# EasyEDA Pro project ProPrj_balance_vehicle_2024-12-26.epro, board balance_vehicle
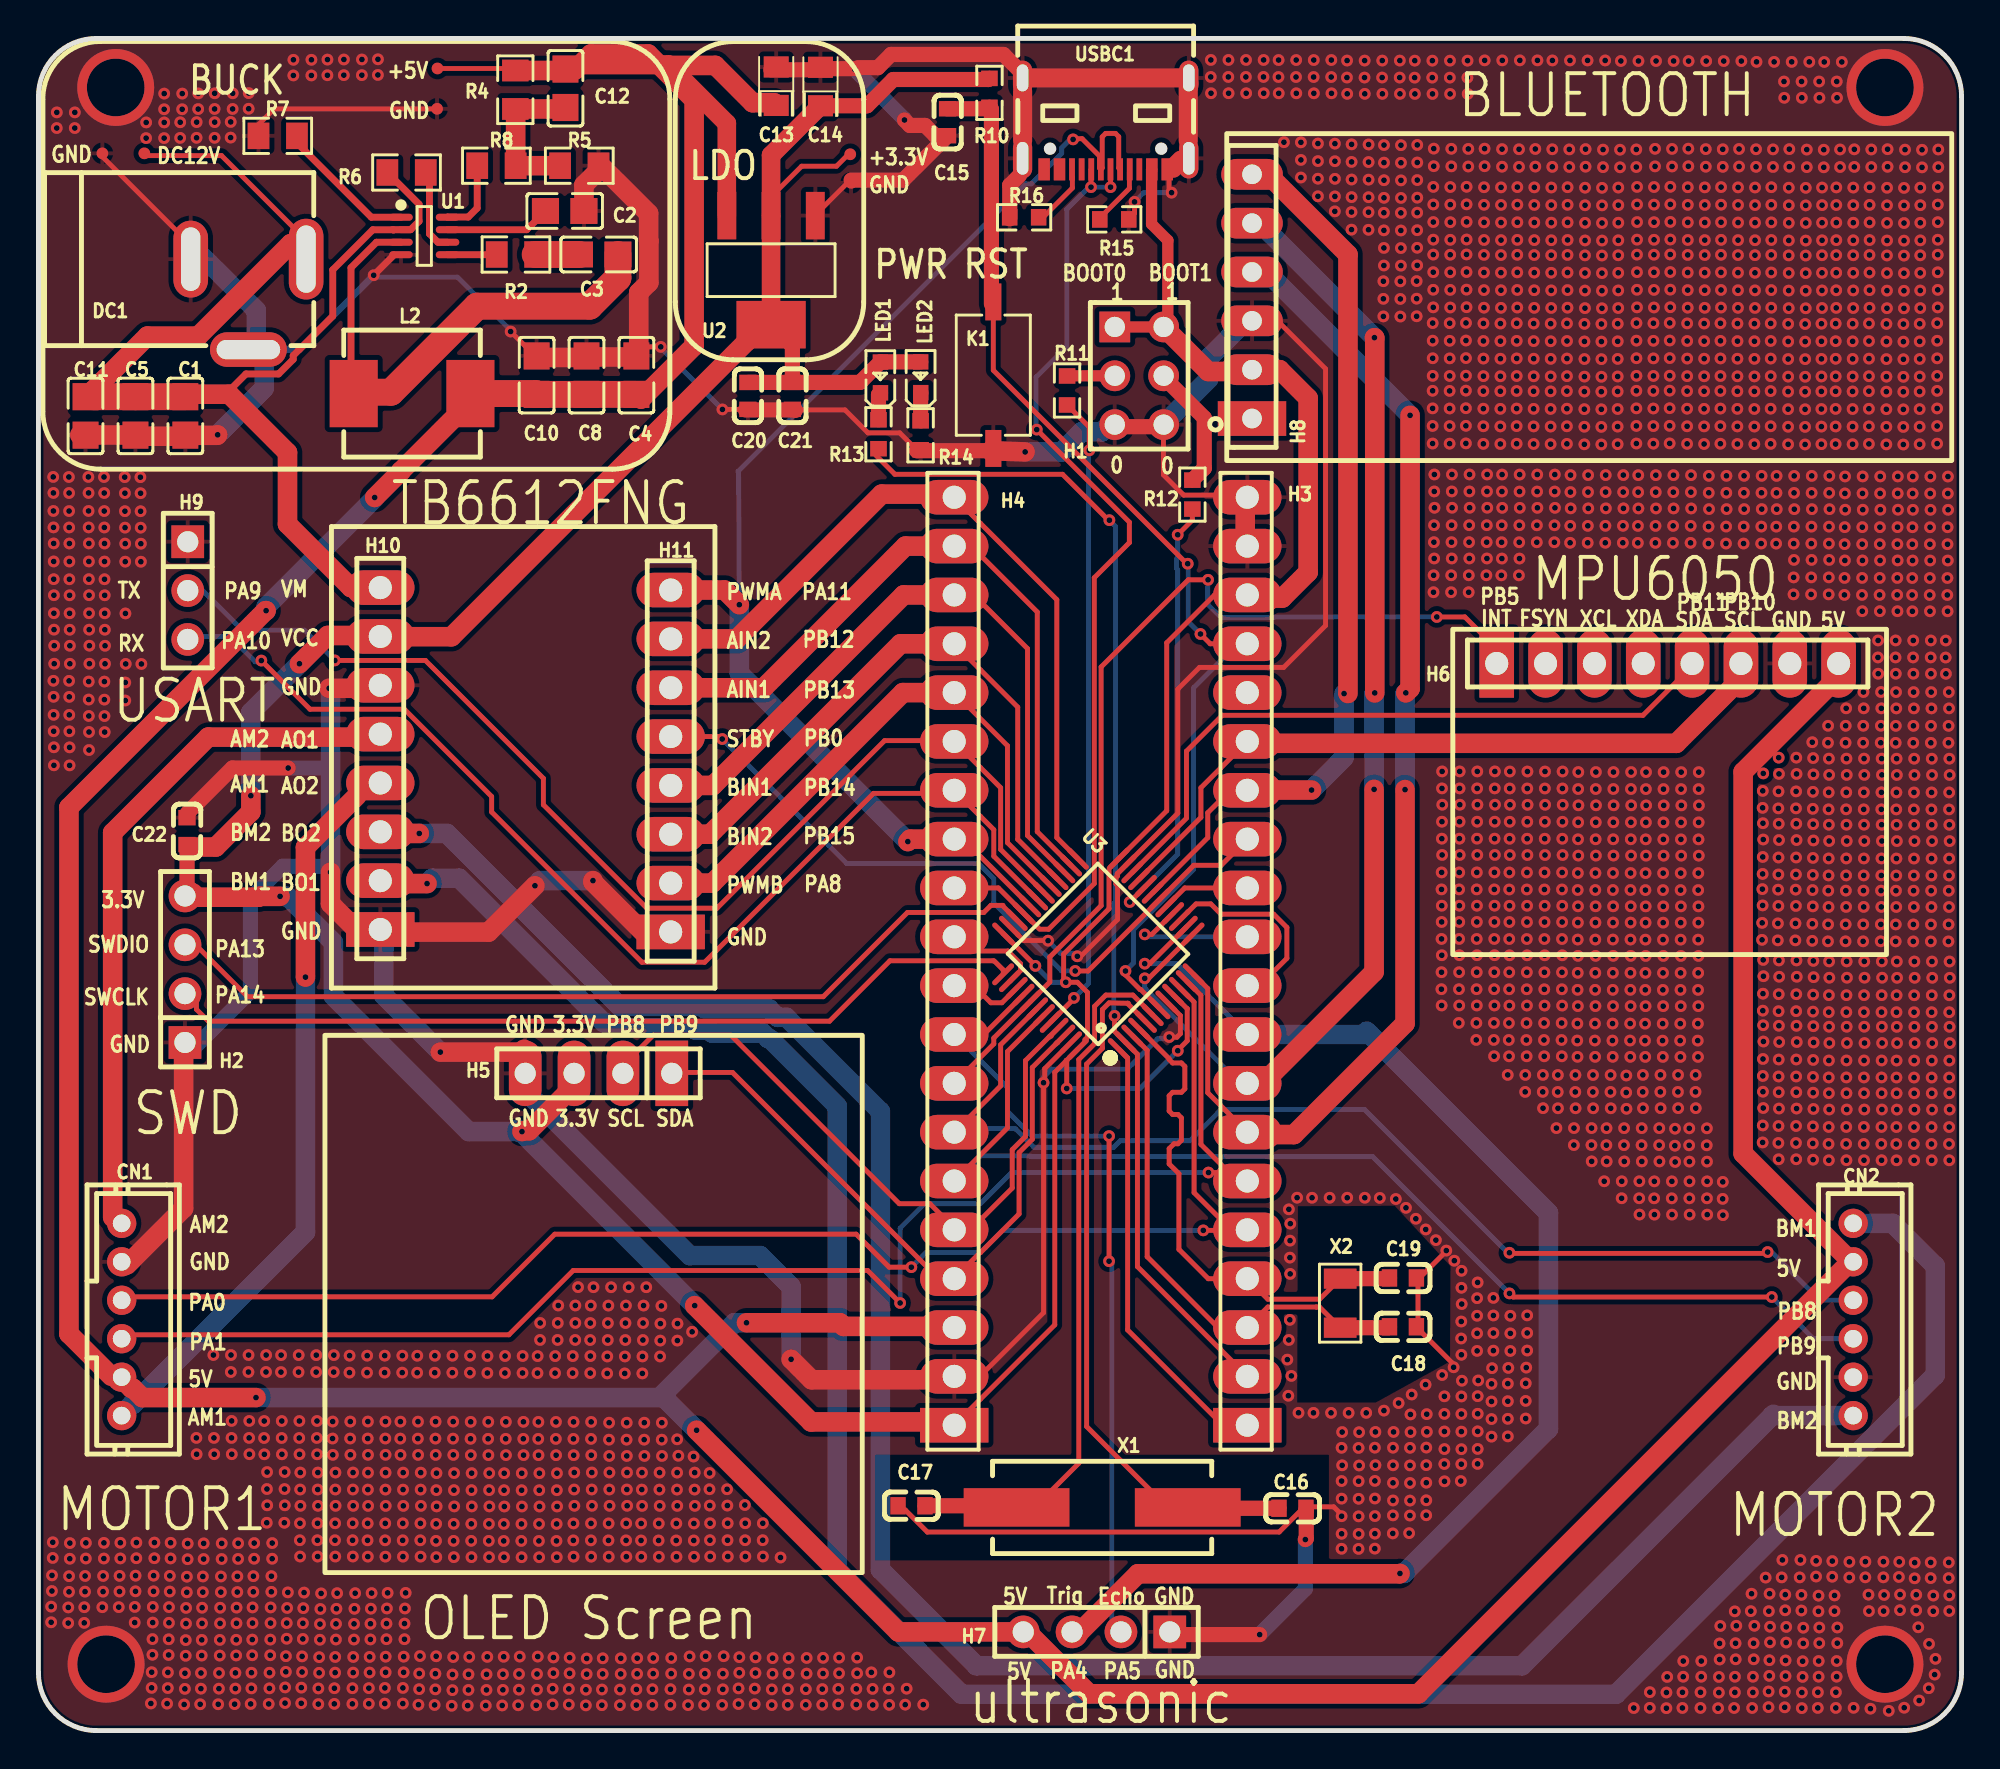
[diagram p2: board, top side]
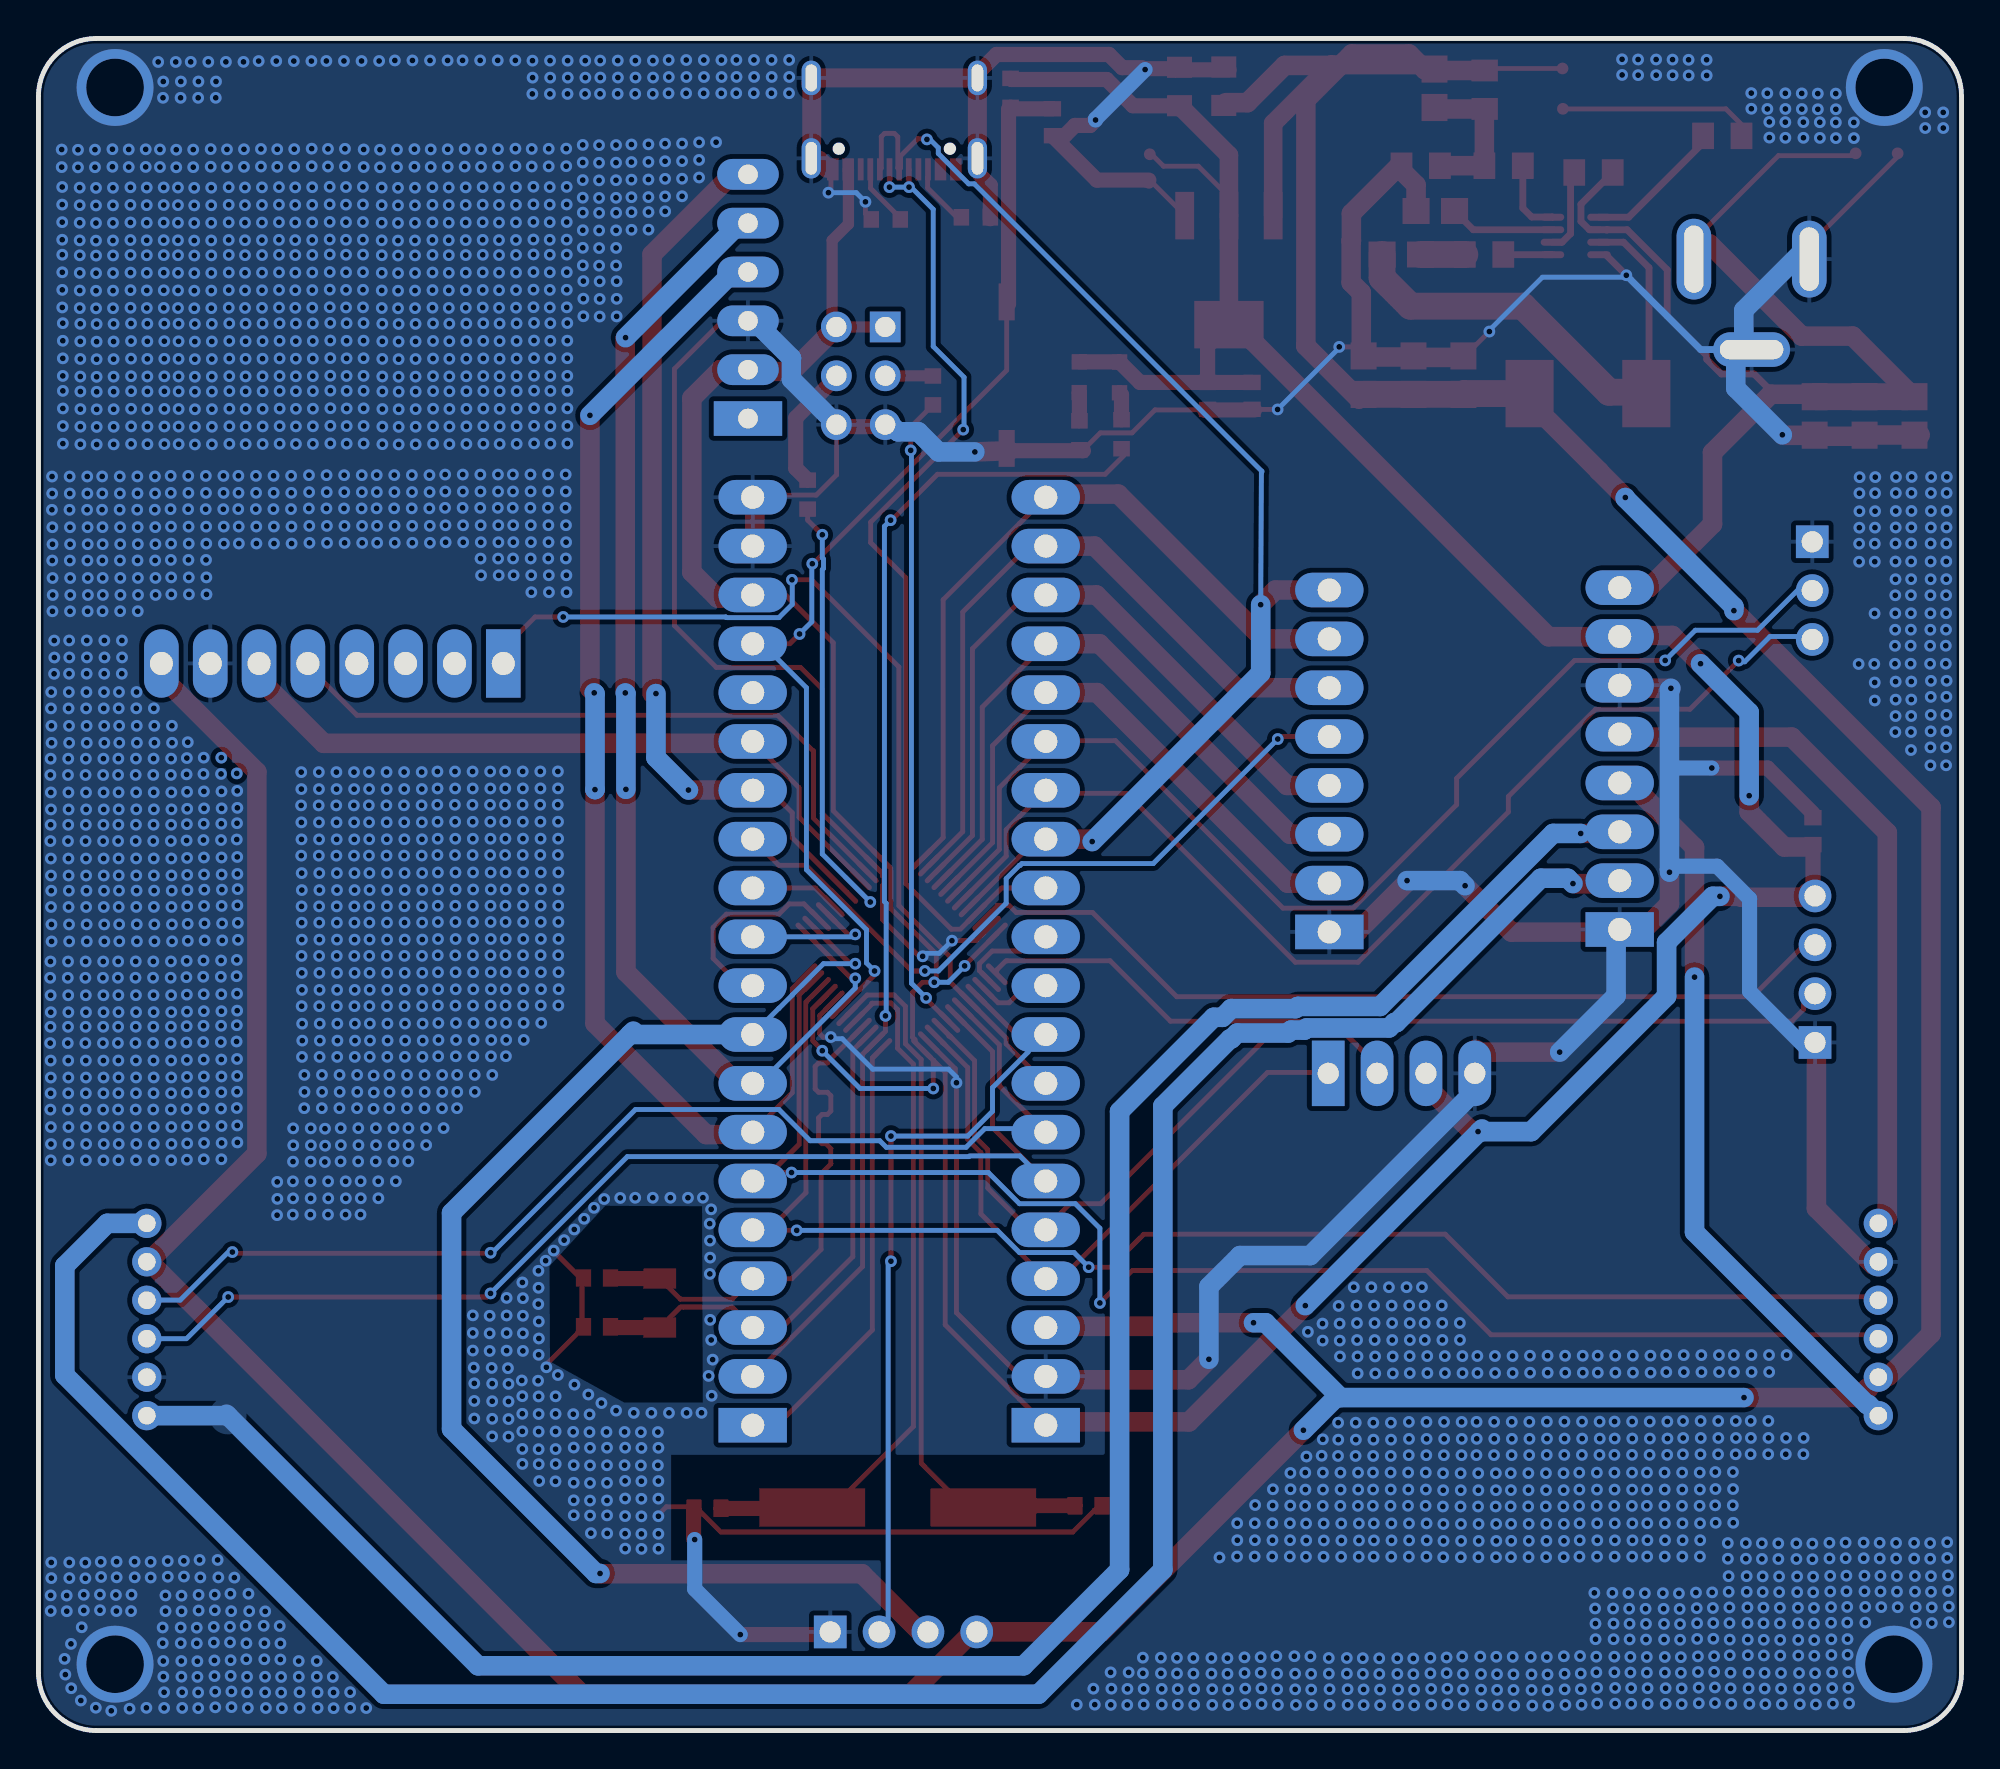
[diagram p3: board, bottom side, seen from below]

Outline 100 x 88 mm; copper layers: Top Layer, Bottom Layer. Coordinates in mm from the lower left corner of the outline.
Outline path: 0,85 0,3 arc(0.88,0.88) 3,0 97,0 arc(99.12,0.88) 100,3 100,85 arc(99.12,87.12) 97,88 3,88 arc(0.88,87.12) 0,85
Stack: Top Layer 0.035mm / Dielectric1 1.51mm FR4 er 4.5 / Bottom Layer 0.035mm

## Design rules (mm)
net PD0-OSC_IN: DP1
net PD1-OSC_OUT: DP1
net PC14: DP2
net PC15: DP2
template: JLCPCB Capability(Two Layers Board)
spacing copperThickness1oz (default): track to track 0.102, other pairs 0.152 to 0.3
spacing copperThickness2oz: track to track 0.203, other pairs 0.152 to 0.3
track width copperThickness1oz (default): min 0.127, default 0.254, max 2.54
track width copperThickness2oz: min 0.203, default 0.254, max 2.54
differential pair differentialPair (default): width min 0.127, default 0.254, max 2.54; gap min 0.152, default 0.152
via viaSize (default): diameter min 0.5, default 0.61, max 10; hole min 0.3, default 0.305, max 6.3

## Placement (name value [footprint] x y rotation side)
C1  100nF  [C0805]  7.64 68.37 90 top
C2  100nF  [C0805]  27.36 79.03 0 top
C3  100nF  [C0805]  29.13 76.76 0 top
C4  22uF  [C0805]  31.09 70.49 90 top
C5  22uF  [C0805]  5.04 68.37 90 top
C8  22uF  [C0805]  28.5 70.49 90 top
C10  22uF  [C0805]  25.9 70.49 90 top
C11  22uF  [C0805]  2.45 68.37 90 top
C12  220pF  [C0805]  27.41 85.41 90 top
C13  10uF  [CAP-SMD_L2.0-W1.3-FD]  38.36 85.52 90 top
C14  10uF  [CAP-SMD_L2.0-W1.3-FD]  40.66 85.5 90 top
C15  1uF  [C0603]  47.27 83.64 270 top
C16  20pF  [C0603]  65.21 11.56 180 top
C17  20pF  [C0603]  45.4 11.69 0 top
C18  10pF  [C0603]  70.95 21 180 top
C19  10pF  [C0603]  70.95 23.54 180 top
C20  100nF  [C0603]  36.89 69.41 270 top
C21  100nF  [C0603]  39.2 69.41 270 top
C22  100nF  [C0603]  7.72 46.78 270 top
CN1  PH2.0D-L-6P  [CONN-TH_6P_PH2.0D-L-6P]  4.33 21.38 270 top
CN2  PH2.0D-L-6P  [CONN-TH_6P_PH2.0D-L-6P]  94.37 21.38 270 top
DC1  DC-005-5A-2.0  [DC-IN-TH_DC-005-5A-2.0]  10.92 74.17 0 top
H1  -  [HDR-TH_6P-P2.54-V-R2-C3-S2.54_A2541WV-2X3P]  57.24 70.46 270 top
H2  -  [HDR-TH_4P-P2.54-V-M]  7.62 39.59 90 top
H3  -  [HDR-TH_20P-P2.54-V-M-1]  62.86 40.01 90 top
H4  -  [HDR-TH_20P-P2.54-V-M-1]  47.62 40.01 90 top
H5  -  [hdr-th_4p-p2.54-v-f]  29.12 34.18 180 top
H6  -  [HDR-TH_8P-P2.54-V-F-1]  84.72 55.49 0 top
H7  -  [hdr-th_4p-p2.54-v-f#2]  55.02 5.13 180 top
H8  -  [hdr-th_6p-p2.54-v-f]  63.1 74.58 90 top
H9  -  [HDR-TH_3P-P2.54-V-M]  7.76 59.29 270 top
H10  -  [HDR-TH_8P-P2.54-V-F-1]  17.78 50.55 90 top
H11  -  [HDR-TH_8P-P2.54-V-F-1]  32.88 50.42 90 top
K1  轻触按键 3x6x2.5mm  [SW-SMD_L6.1-W3.7-LS8.0]  49.65 70.49 270 top
L2  3.3uH  [IND-SMD_L7.1-W6.6_MJC-0603T]  19.43 69.53 180 top
LED1  -  [LED_0603]  43.78 70.42 90 top
LED2  -  [LED_0603]  45.87 70.43 90 top
NOREF  -  [Pad_e5843]  20.73 84.34 0 top
NOREF#2  -  [Pad_e5989]  42.26 80.49 0 top
NOREF#3  -  [Pad_e5856]  3.32 82.03 0 top
NOREF#4  -  [Pad_e5842]  20.75 86.44 0 top
NOREF#5  -  [Pad_e5857]  5.51 82.03 0 top
NOREF#6  -  [Pad_e5990]  42.21 81.98 0 top
R2  10R  [R0805]  24.83 76.76 0 top
R4  100K  [R0805]  24.8 85.33 90 top
R5  13.7K  [R0805]  28.12 81.38 0 top
R6  100K  [R0805]  19.14 81.03 0 top
R7  0R  [R0805]  12.44 82.94 0 top
R8  0R  [R0805]  23.81 81.38 0 top
R10  10K  [R0603]  49.45 85.17 270 top
R11  100K  [R0603]  53.49 69.69 90 top
R12  100K  [R0603]  60 64.28 270 top
R13  510R  [R0603]  43.68 67.42 270 top
R14  510R  [R0603]  45.87 67.36 270 top
R15  5.1K  [R0603]  55.94 78.59 0 top
R16  5.1K  [R0603]  51.26 78.7 180 top
U1  MP2236  [SOT-23-8_L3.0-W1.7-P0.65-LS2.8-BL]  20.06 77.73 270 top
U2  AMS1117-3.3  [SOT-223-4_L6.5-W3.5-P2.30-LS7.0-BR]  38.1 75.95 90 top
U3  STM32F103C8T6  [LQFP-48_L7.0-W7.0-P0.50-LS9.0-BL]  55.11 40.39 45 top
USBC1  MC-311D  [USB-C-SMD_MC-311D]  55.49 83.57 180 top
X1  8MHz  [CRYSTAL-SMD_L11.5-W4.8-LS12.7]  55.31 11.6 180 top
X2  32.768kHz  [OSC-SMD_L3.2-W1.5]  67.69 22.23 270 top

## Footprints (pads in the part's own frame, mm; a bottom-side part is the same pattern mirrored in y, then rotated)
C0603
  rect 0.8x0.9 smd: 1(-0.7,0) 2(0.7,0)
C0805
  rect 1.41x1.35 smd: 1(-1,0) 2(1,0)
CAP-SMD_L2.0-W1.3-FD
  rect 1.1x1.3 smd: 1(-1,0) 2(1,0)
CONN-TH_6P_PH2.0D-L-6P
  round 1.524 hole 0.914: 1(-5,0) 2(-3,0) 3(-1,0) 4(1,0) 5(3,0) 6(5,0)
CRYSTAL-SMD_L11.5-W4.8-LS12.7
  rect 5.5x2 smd: 1(-4.45,0) 2(4.45,0)
DC-IN-TH_DC-005-5A-2.0
  oval 1.8x4.2 hole 1x3.5: 1(3,2.352)
  oval 1.8x4 hole 1x3.3: 2(-3,2.352)
  oval 4x1.8 hole 3.3x1: 3(-0.001,-2.352)
HDR-TH_3P-P2.54-V-M
  rect 1.7x1.7 hole 1.1: 1(-2.54,0)
  round 1.7 hole 1.1: 2(0,0) 3(2.54,0)
hdr-th_4p-p2.54-v-f
  rect 1.7x3.404 hole 1.1x0.003: 1(-3.81,0)
  oval 1.7x3.404 hole 1.1x0.003: 2(-1.27,0) 3(1.27,0) 4(3.81,0)
hdr-th_4p-p2.54-v-f#2
  rect 1.7x1.7 hole 1.1: 1(-3.81,0)
  round 1.7 hole 1.1: 2(-1.27,0) 3(1.27,0) 4(3.81,0)
HDR-TH_4P-P2.54-V-M
  rect 1.7x1.7 hole 1.1: 1(-3.81,0)
  round 1.7 hole 1.1: 2(-1.27,0) 3(1.27,0) 4(3.81,0)
hdr-th_6p-p2.54-v-f
  rect 1.8x3.556 hole 1.02x0.003: 1(-6.35,0)
  oval 1.6x3.2 hole 1.02x0.003: 2(-3.81,0) 3(-1.27,0) 4(1.27,0) 5(3.81,0) 6(6.35,0)
HDR-TH_6P-P2.54-V-R2-C3-S2.54_A2541WV-2X3P
  rect 1.6x1.6 hole 1.05: 1(-2.54,-1.27)
  round 1.6 hole 1.05: 2(-2.54,1.27) 3(0,-1.27) 4(0,1.27) 5(2.54,-1.27) 6(2.54,1.27)
HDR-TH_8P-P2.54-V-F-1
  rect 1.8x3.556 hole 1.2x0.003: 1(-8.89,0)
  oval 1.8x3.556 hole 1.2x0.003: 2(-6.35,0) 3(-3.81,0) 4(-1.27,0) 5(1.27,0) 6(3.81,0) 7(6.35,0) 8(8.89,0)
HDR-TH_20P-P2.54-V-M-1
  rect 1.8x3.556 hole 1.2x0.003: 1(-24.13,0)
  oval 1.8x3.556 hole 1.2x0.003: 2(-21.59,0) 3(-19.05,0) 4(-16.51,0) 5(-13.97,0) 6(-11.43,0) 7(-8.89,0) 8(-6.35,0) 9(-3.81,0) 10(-1.27,0) 11(1.27,0) 12(3.81,0) 13(6.35,0) 14(8.89,0) 15(11.43,0) 16(13.97,0) 17(16.51,0) 18(19.05,0) 19(21.59,0) 20(24.13,0)
IND-SMD_L7.1-W6.6_MJC-0603T
  rect 2.5x3.5 smd: 1(-3.035,0) 2(3.035,0)
LED_0603
  rect 0.8x0.8 smd: 1(-0.851,-0.01) 2(0.75,-0.005)
LQFP-48_L7.0-W7.0-P0.50-LS9.0-BL
  oval 0.27x1.5 smd: 1(-2.75,-4.25) 2(-2.25,-4.25) 3(-1.75,-4.25) 4(-1.25,-4.25) 5(-0.75,-4.25) 6(-0.25,-4.25) 7(0.25,-4.25) 8(0.75,-4.25) 9(1.25,-4.25) 10(1.75,-4.25) 11(2.25,-4.25) 12(2.75,-4.25) 25(2.75,4.25) 26(2.25,4.25) 27(1.75,4.25) 28(1.25,4.25) 29(0.75,4.25) 30(0.25,4.25) 31(-0.25,4.25) 32(-0.75,4.25) 33(-1.25,4.25) 34(-1.75,4.25) 35(-2.25,4.25) 36(-2.75,4.25)
  oval 1.5x0.27 smd: 13(4.25,-2.75) 14(4.25,-2.25) 15(4.25,-1.75) 16(4.25,-1.25) 17(4.25,-0.75) 18(4.25,-0.25) 19(4.25,0.25) 20(4.25,0.75) 21(4.25,1.25) 22(4.25,1.75) 23(4.25,2.25) 24(4.25,2.75) 37(-4.25,2.75) 38(-4.25,2.25) 39(-4.25,1.75) 40(-4.25,1.25) 41(-4.25,0.75) 42(-4.25,0.25) 43(-4.25,-0.25) 44(-4.25,-0.75) 45(-4.25,-1.25) 46(-4.25,-1.75) 47(-4.25,-2.25) 48(-4.25,-2.75)
OSC-SMD_L3.2-W1.5
  rect 1.05x1.7 smd: 1(-1.275,0) 2(1.275,0)
Pad_e5842
  round 0.61 smd: TP1(0,0)
Pad_e5843
  round 0.61 smd: TP2(0,0)
Pad_e5856
  round 0.61 smd: TP3(0,0)
Pad_e5857
  round 0.61 smd: TP4(0,0)
Pad_e5989
  round 0.61 smd: TP5(0,0)
Pad_e5990
  round 0.61 smd: TP6(0,0)
R0603
  rect 0.806x0.864 smd: 1(-0.753,0) 2(0.753,0)
R0805
  rect 1.133x1.377 smd: 1(-1,0) 2(1,0)
SOT-23-8_L3.0-W1.7-P0.65-LS2.8-BL
  oval 0.364x1.222 smd: 1(-0.975,-1.211) 2(-0.325,-1.211) 3(0.325,-1.211) 4(0.975,-1.211) 5(0.975,1.211) 6(0.325,1.211) 7(-0.325,1.211) 8(-0.975,1.211)
SOT-223-4_L6.5-W3.5-P2.30-LS7.0-BR
  rect 2.47x0.98 smd: 1(2.835,-2.3) 2(2.835,0) 3(2.835,2.3)
  rect 2.47x3.6 smd: 4(-2.835,0)
SW-SMD_L6.1-W3.7-LS8.0
  rect 1.92x0.84 smd: 1(3.81,0) 2(-3.81,0)
USB-C-SMD_MC-311D
  oval 1x2.1 hole 0.6x1.7: 1(-4.32,1.802) 4(4.32,1.802)
  oval 1x1.8 hole 0.6x1.4: 2(-4.32,-2.377) 3(4.32,-2.377)
  rect 0.6x1.15 smd: A1-B12(-3.2,2.377) A4-B9(-2.4,2.377) B1-A12(3.2,2.377) B4-A9(2.4,2.377)
  rect 0.3x1.15 smd: A5(-1.25,2.377) A6(-0.25,2.377) A7(0.25,2.377) A8(1.25,2.377) B5(1.75,2.377) B6(0.75,2.377) B7(-0.75,2.377) B8(-1.75,2.377)

## Nets
As in the schematic, except:
12V_DC: C1.2 C5.2 C11.2 DC1.1 H10.8 NOREF#5.TP4 R6.1 U1.2
+5V: C4.1 C8.1 C10.1 C12.2 C13.1 CN1.5 CN2.2 H4.3 H6.8 H7.4 L2.1 NOREF#4.TP1 R4.2 U2.3
GND: C1.1 C2.2 C4.2 C5.1 C8.2 C10.2 C11.1 C13.2 C14.2 C15.2 C16.1 C17.1 C18.1 C19.1 C20.2 C21.2 C22.1 CN1.2 CN2.5 DC1.2 DC1.3 H1.5 H1.6 H2.1 H3.19 H3.20 H4.2 H5.4 H6.7 H7.1 H8.3 H9.1 H10.1 H10.6 H11.1 K1.1 NOREF.TP2 NOREF#2.TP5 NOREF#3.TP3 R5.2 R7.1 R14.2 R15.2 R16.2 U1.4 U2.1 U3.8 U3.23 U3.35 U3.47 USBC1.1 USBC1.2 USBC1.3 USBC1.4 USBC1.A1-B12
SWD_3.3V: C14.1 C20.1 C21.1 C22.2 H1.1 H1.2 H2.4 H3.18 H4.1 H5.3 H8.2 H10.7 LED1.2 LED2.2 NOREF#6.TP6 R10.1 U2.2 U2.4 U3.9 U3.24 U3.36 U3.48 USBC1.A4-B9

Pads without a net: H6 2 3 4; H8 1; USBC1 A8 B1-A12 B4-A9 B8

## Via types
v1: diameter 0.61, hole 0.305, Top Layer to Bottom Layer, 2711 vias
v2: diameter 4, hole 3, Top Layer to Bottom Layer, 4 vias

## Routing (per net, layer and track width the routed paths; a pad name or vN(x,y) marks a point on that pad's centre or on a via; arc(x,y) is an arc through that point)
12V_DC: length 63.6
  Top Layer w0.254: 5.64,81.91 9.52,81.91 13.39,78.03
  Top Layer w0.355: R6.1 19.79,79.38 19.79,78.49 19.35,78.05 U1.2 ; 9.96,69.53 9.96,69.72 10.79,70.55 12.49,70.55 13.25,71.31 13.25,71.51 15.3,73.56 15.3,75.97 17.38,78.05 18.44,78.05 18.46,78.03
  Top Layer w1.016: 13.92,76.52 13.12,77.33 8.31,72.52 5.66,72.52 2.83,69.69 2.83,69.37 ; H10.8 16.25,59.44 12.95,62.74 12.95,66.47 9.92,69.5 7.76,69.5 C1.2
  Top Layer w1.397: 2.83,69.37 C5.2 C1.2
+5V: length 276.6
  Top Layer w0.254: NOREF#4.TP1 24.85,86.44 24.88,86.4
  Top Layer w0.965: 32.76,86.62 35.8,83.58 U2.3 ; 28.15,86.62 32.54,86.62
  Top Layer w1.016: v1(34.22,15.62) 44.71,5.13 H7.4 51.42,5.13 54.64,1.91 71.75,1.91 94.25,24.41 88.64,30.01 88.64,49.86 93.85,55.06 ; 32.54,86.62 32.78,86.62 ; 32.78,86.6 35.2,86.6 37.13,84.66 38.26,84.66 ; v1(11.31,17.32) 5.4,17.32 4.92,17.8 4.83,17.8 4.42,18.21 ; 21.51,68.16 18.85,65.51 18.85,65.5 v1(17.48,64.13) ; C4.1 31.34,69.25 34.1,72.01 34.1,84.8 32.28,86.62 31.71,87.19 28.73,87.19 27.9,86.36 27.45,86.36 C12.2 27.33,86.33 R4.2 ; 41.86,21.02 41.67,21.21 v1(36.82,21.21) ; v1(11.84,58.24) 11.82,58.24 1.59,48.01 1.59,20.63 3.79,18.43 ; 41.87,21.02 46.99,21.02
  Top Layer w1.397: C4.1 C8.1 C10.1 25.86,69.53 L2.1
  Bottom Layer w1.016: v1(36.82,21.21) 36.19,21.21 32.3,17.32 v1(11.31,17.32) ; v1(34.22,15.62) 32.54,17.31 32.54,17.35 ; v1(11.84,58.24) 11.84,58.44 17.48,64.09 v1(17.48,64.13)
  vias: v1(89.69,49.78) v1(90.49,50.6)
AGND: length 7.4
  Top Layer w0.355: U1.1 17.31,78.7 13.44,82.57 R7.2
GND: length 386.4
  Top Layer w0.254: 67.86,11.13 67.35,11.64 65.93,11.64 ; 44.54,11.47 45.07,11.47 46.22,10.32 64.52,10.32 65.67,11.47 ; 53.28,35.37 52.32,34.42 52.32,33.87 52.31,33.86 ; 56.11,44.58 56.11,44.45 56.03,44.37 56.03,44.03 56.11,43.95 56.11,42.18 54.2,40.27 v1(54.02,40.27) ; v1(24.55,72.76) 25.47,71.84 ; v1(52.26,33.69) 52.26,21.73 48.84,18.31 ; 58.5,67.42 58.5,65.31 59.55,64.25 61.25,64.25 61.58,63.92 ; 20.6,84.34 12.26,84.34 11.26,83.34 ; 58.79,80.77 58.79,80.11 v1(58.92,79.98) ; 71.74,21.05 71.74,23.49 ; 7.37,77.91 7.27,77.91 3.33,81.84 ; 52.36,41.02 52.3,41.09 51.23,41.09 50.92,41.4 ; 71.64,21 73.51,19.12 73.51,18.97 ; 31.36,71.64 31.67,71.96 v1(32.36,71.96) ; 64.52,73.29 64.56,73.26 64.56,73.19 66.93,70.82 66.93,57.47 64.75,55.29 60.37,55.29 59.25,54.17 59.25,47.71 ; 56.7,78.61 57,78.9 v1(57,79.5) ; 36.72,68.71 v1(35.56,68.71) ; 45.72,66.55 45.71,66.56 44.78,67.49 43.13,67.49 41.94,68.68 39.33,68.68 ; 65.93,11.46 65.98,11.41 ; 71.77,23.49 73.19,24.91 73.24,24.91 ; v1(58.8,36.07) 58.8,36.06 59.2,36.06 59.38,36.24 59.38,37.18 59.08,37.48 ; U3.23 59.25,47.7 ; 71.74,23.62 71.61,23.75 ; 40.35,78.77 42.08,80.5
  Top Layer w0.355: 18.49,76.75 v1(17.43,75.69)
  Top Layer w0.787: 39.36,68.66 39.33,68.68 36.76,68.68 ; 56.52,67.81 57.98,67.81 ; 65.93,11.52 65.93,9.98 v1(65.88,9.93) ; 51.04,86.31 50.18,87.17 44.33,87.17 43.65,86.48 42.62,86.48 ; v1(12.99,50.06) 10.09,50.06 7.74,47.71 ; 49.51,66.56 45.66,66.56 ; v1(45.03,83.76) 45.31,83.48 46.1,83.48 46.64,82.94 C15.2 44.96,80.63 42.26,80.63 ; 41.02,86.52 40.88,86.37 38.09,86.37 ; 49.56,66.56 49.67,66.67 ; 58.98,5.21 59.2,4.99 v1(63.5,4.99) ; 50.51,78.63 50.51,80.37 51.01,80.88 ; 41.04,86.43 42.41,86.43
  Top Layer w0.991: 51.18,82.69 51.18,85.25 ; 59,81.25 59.42,81.67 ; 59.79,82.69 59.79,85.64 59.82,85.67 ; 51.63,85.95 59.46,85.95
  Top Layer w1.016: 18.89,41.56 18.92,41.52 23.4,41.52 v1(25.82,43.94) ; v1(15.11,54.2) 17.73,54.2 17.85,54.33 ; 28.82,71.41 28.84,71.44 ; 28.84,71.44 31.09,71.44 ; 28.84,71.44 28.87,71.46 ; 25.9,71.41 28.4,71.41 ; 2.15,67.38 5.15,67.38 5.2,67.43 ; 4.61,24.22 7.55,27.16 7.55,35.34 ; v1(9.32,67.39) 9.29,67.36 7.92,67.36 ; 29.1,81.11 28.36,80.38 C2.2 ; 25.25,35.43 25.1,35.28 v1(20.9,35.28) ; 31.21,71.56 31.21,74.78 31.74,75.31 31.74,77.47 31.73,77.48 31.73,78.9 29.26,81.37 ; 5.15,67.31 7.78,67.31 ; 49.51,66.56 v1(51.31,66.5) ; 47.32,18.24 40.2,18.24 v1(39.14,19.31) ; v1(28.83,44.2) 28.83,44.13 31.44,41.52 ; 62.75,61.52 62.75,63.76 62.42,64.09 ; v1(15.19,44.64) 15.19,43 16.68,41.51
  Bottom Layer w0.254: v1(32.36,71.96) 32.36,71.91 v1(35.56,68.71) ; v1(52.5,41.08) 53.16,40.42 53.92,40.42 ; 17.47,75.58 21.79,75.58 24.55,72.82 v1(24.55,72.76) ; 52.27,33.68 52.27,33.99 52.67,34.4 56.62,34.4 58.2,35.98 58.7,35.98 ; v1(58.92,79.98) 57.48,79.98 v1(57,79.5)
  Bottom Layer w0.355: v1(17.43,75.69) 13.57,71.82 12.67,71.82
  Bottom Layer w0.787: v1(63.5,4.99) 65.88,7.36 v1(65.88,9.93) ; 8,35.42 11.02,38.44 11.02,43.26 12.71,44.95 15.03,44.95 15.19,44.79 15.27,44.71 ; v1(12.99,50.06) 15.11,50.06 ; v1(45.03,83.76) 45.03,83.81 v1(42.45,86.38)
  Bottom Layer w1.016: 55.69,67.93 55.31,67.54 54.24,67.54 53.2,66.5 v1(51.31,66.5) ; 11.32,72.57 11.32,73.86 8.41,76.77 ; v1(15.11,54.2) 15.19,54.13 v1(15.19,44.64) ; v1(39.14,19.31) 39.14,23.09 37.52,24.7 33.86,24.7 25.52,33.05 ; 58.91,68.35 60.84,70.28 60.84,71.38 62.56,73.09 62.68,73.09 ; v1(20.9,35.28) 17.96,38.22 17.96,42 ; 11.74,71.4 11.74,69.81 v1(9.32,67.39) ; v1(28.83,44.2) 26.08,44.2 v1(25.82,43.94)
  vias: v1(0.66,6.44) v1(0.66,5.63) v1(0.77,65.2) v1(0.75,9.79) v1(0.74,8.98) v1(0.7,8.07) v1(0.7,7.26) v1(0.78,64.36) v1(0.78,63.43) v1(0.78,62.57) v1(0.79,61.74) v1(0.79,60.8) v1(0.79,59.88) v1(0.8,59.05) v1(0.8,58.11) v1(0.81,57.25) v1(0.82,56.42) v1(0.82,55.48) v1(0.78,54.59) v1(0.79,53.76) v1(0.79,52.82) v1(0.79,51.97) v1(0.8,51.14) v1(0.8,50.2) v1(0.95,84.16) v1(0.95,83.34) v1(1.55,6.4) v1(1.55,5.59) v1(1.58,65.19) v1(1.59,64.36) v1(1.59,63.42) v1(1.6,62.57) v1(1.61,61.73) v1(1.61,60.8) v1(1.61,59.88) v1(1.62,59.04) v1(1.62,58.1) v1(1.62,57.25) v1(1.63,56.42) v1(1.63,55.48) v1(1.59,54.59) v1(1.6,53.76) v1(1.6,52.82) v1(1.61,51.97) v1(1.62,51.13) v1(1.62,50.2) v1(1.63,9.75) v1(1.63,8.94) v1(1.59,8.03) v1(1.59,7.21) v1(1.89,84.16) v1(1.89,83.34) v1(2.47,9.76) v1(2.46,8.95) v1(2.42,8.04) v1(2.42,7.22) v1(2.38,6.41) v1(2.38,5.6) v1(2.59,65.2) v1(2.6,64.36) v1(2.6,63.43) v1(2.61,62.57) v1(2.62,61.74) v1(2.62,60.8) v1(2.62,59.88) v1(2.63,59.05) v1(2.63,58.11) v1(2.64,57.25) v1(2.65,56.42) v1(2.65,55.48) v1(2.61,54.56) v1(2.61,53.62) v1(2.62,52.76) v1(2.63,51.93) v1(2.63,50.99) v1(3.36,8.04) v1(3.36,7.22) v1(3.32,6.41) v1(3.41,65.19) v1(3.42,64.36) v1(3.42,63.42) v1(3.42,62.57) v1(3.44,61.73) v1(3.44,60.8) v1(3.44,59.88) v1(3.45,59.04) v1(3.45,58.1) v1(3.45,57.25) v1(3.46,56.42) v1(3.46,55.48) v1(3.43,54.55) v1(3.43,53.62) v1(3.43,52.76) v1(3.44,51.93) v1(3.4,9.76) v1(3.4,8.95) v1(4.26,9.77) v1(4.25,8.95) v1(4.22,8.04) v1(4.21,7.23) v1(4.17,6.42) v1(4.49,65.19) v1(4.5,64.35) v1(4.5,63.42) v1(4.5,62.56) v1(4.51,61.73) v1(4.51,60.79) v1(4.52,58.1) v1(4.54,55.47) v1(4.51,54.51) v1(4.51,53.57) v1(5.05,8.05) v1(5.05,7.24) v1(5.01,6.43) v1(5,5.62) v1(5.09,9.78) v1(5.09,8.96) v1(5.3,65.18) v1(5.31,64.35) v1(5.31,63.41) v1(5.32,62.56) v1(5.33,61.72) v1(5.33,60.79) v1(5.35,55.47) v1(5.6,83.63) v1(5.6,82.82) v1(5.85,1.41) v1(5.95,6.43) v1(5.94,5.62) v1(5.93,4.76) v1(5.93,3.94) v1(5.89,3.03) v1(5.88,2.22) v1(6.03,9.78) v1(6.03,8.96) v1(5.99,8.05) v1(5.98,7.24) v1(6.54,85.13) v1(6.53,84.32) v1(6.54,83.63) v1(6.53,82.82) v1(6.73,3.02) v1(6.73,2.21) v1(6.69,1.4) v1(6.83,8.04) v1(6.83,7.23) v1(6.79,6.42) v1(6.78,5.6) v1(6.77,4.75) v1(6.77,3.93) v1(6.87,9.77) v1(6.87,8.95) v1(7.37,83.64) v1(7.37,82.83) v1(7.48,85.13) v1(7.47,84.32) v1(7.66,4.7) v1(7.66,3.89) v1(7.62,2.98) v1(7.61,2.17) v1(7.58,1.36) v1(7.76,9.72) v1(7.76,8.91) v1(7.72,8) v1(7.71,7.19) v1(7.68,6.38) v1(7.67,5.56) v1(8.23,83.65) v1(8.22,82.83) v1(8.21,15.22) v1(8.22,14.37) v1(8.31,85.14) v1(8.31,84.33) v1(8.45,2.99) v1(8.45,2.18) v1(8.41,1.37) v1(8.55,8.01) v1(8.55,7.2) v1(8.51,6.39) v1(8.51,5.57) v1(8.49,4.71) v1(8.49,3.9) v1(8.59,9.73) v1(8.59,8.92) v1(9.16,85.15) v1(9.16,84.33) v1(9.16,83.65) v1(9.16,82.83) v1(9.1,19.53) v1(9.12,15.22) v1(9.14,14.37) v1(9.35,1.37) v1(9.45,6.39) v1(9.44,5.57) v1(9.43,4.71) v1(9.43,3.9) v1(9.39,2.99) v1(9.38,2.18) v1(9.53,9.73) v1(9.53,8.92) v1(9.49,8.01) v1(9.48,7.2) v1(10,83.66) v1(9.99,82.84) v1(10.01,19.53) v1(10,18.65) v1(10.05,16.1) v1(10.04,15.22) v1(10.05,14.37) v1(10.1,85.15) v1(10.1,84.33) v1(10.24,3) v1(10.24,2.18) v1(10.2,1.37) v1(10.34,8.02) v1(10.34,7.2) v1(10.3,6.39) v1(10.3,5.58) v1(10.28,4.72) v1(10.28,3.91) v1(10.38,9.74) v1(10.38,8.93) v1(10.93,85.16) v1(10.93,84.34) v1(10.92,19.53) v1(10.92,18.65) v1(10.96,16.1) v1(10.95,15.22) v1(10.97,14.37) v1(11.03,1.38) v1(11.13,6.4) v1(11.13,5.59) v1(11.12,4.73) v1(11.11,3.92) v1(11.08,3.01) v1(11.07,2.19) v1(11.22,9.75) v1(11.21,8.94) v1(11.18,8.03) v1(11.17,7.21) v1(11.74,16.1) v1(11.73,15.22) v1(11.75,14.37) v1(11.84,19.53) v1(11.83,18.65) v1(11.89,13.44) v1(11.88,12.56) v1(11.89,11.71) v1(11.87,10.81) v1(12.05,4.73) v1(12.05,3.92) v1(12.01,3.01) v1(12.01,2.19) v1(11.97,1.38) v1(12.16,9.75) v1(12.15,8.94) v1(12.11,8.03) v1(12.11,7.21) v1(12.07,6.4) v1(12.07,5.59) v1(12.62,19.53) v1(12.61,18.64) v1(12.65,16.1) v1(12.65,15.22) v1(12.66,14.37) v1(12.8,13.44) v1(12.8,12.56) v1(12.81,11.71) v1(12.79,10.81) v1(12.86,3.05) v1(12.83,2.24) v1(12.82,1.43) v1(12.93,6.37) v1(12.91,5.59) v1(12.91,4.78) v1(12.87,3.87) v1(12.97,7.19) v1(13.26,86.89) v1(13.25,86.08) v1(13.53,19.53) v1(13.52,18.64) v1(13.56,15.22) v1(13.57,16.1) v1(13.57,14.37) v1(13.61,13.42) v1(13.61,12.53) v1(13.62,11.69) v1(13.6,10.78) v1(13.59,9.9) v1(13.6,9.05) v1(13.66,1.42) v1(13.75,5.58) v1(13.75,4.76) v1(13.71,3.86) v1(13.71,3.04) v1(13.67,2.23) v1(13.81,7.18) v1(13.77,6.36) v1(14.19,86.89) v1(14.19,86.08) v1(14.45,19.53) v1(14.44,18.64) v1(14.48,16.1) v1(14.47,15.22) v1(14.49,14.37) v1(14.53,13.42) v1(14.52,12.53) v1(14.54,11.69) v1(14.51,10.78) v1(14.5,9.9) v1(14.52,9.05) v1(14.56,2.19) v1(14.55,1.38) v1(14.66,6.32) v1(14.64,5.54) v1(14.63,4.72) v1(14.6,3.82) v1(14.59,3) v1(14.7,7.13) v1(15.03,86.9) v1(15.02,86.09) v1(15.36,19.53) v1(15.35,18.64) v1(15.3,16.07) v1(15.29,15.19) v1(15.31,14.34) v1(15.44,13.42) v1(15.44,12.53) v1(15.45,11.69) v1(15.43,10.78) v1(15.42,9.9) v1(15.43,9.05) v1(15.43,3.83) v1(15.43,3.01) v1(15.39,2.2) v1(15.38,1.39) v1(15.53,7.14) v1(15.49,6.33) v1(15.47,5.55) v1(15.47,4.73) v1(15.88,86.91) v1(15.88,86.09) v1(16.18,19.5) v1(16.17,18.61) v1(16.21,16.07) v1(16.21,15.19) v1(16.22,14.34) v1(16.36,13.42) v1(16.35,12.53) v1(16.36,11.69) v1(16.34,10.78) v1(16.33,9.9) v1(16.35,9.05) v1(16.36,3.01) v1(16.33,2.2) v1(16.32,1.39) v1(16.43,6.33) v1(16.41,5.55) v1(16.41,4.73) v1(16.37,3.83) v1(16.47,7.14) v1(16.82,86.91) v1(16.82,86.09) v1(17.09,19.5) v1(17.09,18.61) v1(17.13,16.07) v1(17.12,15.19) v1(17.14,14.34) v1(17.14,13.41) v1(17.13,12.53) v1(17.14,11.68) v1(17.12,10.78) v1(17.11,9.89) v1(17.13,9.05) v1(17.26,5.55) v1(17.26,4.74) v1(17.22,3.83) v1(17.22,3.02) v1(17.18,2.21) v1(17.18,1.39) v1(17.32,7.15) v1(17.28,6.34) v1(17.65,86.92) v1(17.65,86.1) v1(18.01,19.5) v1(18,18.61) v1(18.04,16.07) v1(18.04,15.19) v1(18.05,14.34) v1(18.05,13.41) v1(18.04,12.53) v1(18.06,11.68) v1(18.03,10.78) v1(18.03,9.89) v1(18.04,9.05) v1(18.06,3.84) v1(18.05,3.03) v1(18.01,2.22) v1(18.01,1.4) v1(18.16,7.16) v1(18.12,6.35) v1(18.1,5.56) v1(18.09,4.75) v1(18.82,16.07) v1(18.81,15.18) v1(18.83,14.34) v1(18.92,19.5) v1(18.91,18.61) v1(18.96,13.41) v1(18.96,12.53) v1(18.95,10.78) v1(18.94,9.89) v1(18.95,9.05) v1(18.95,2.22) v1(18.95,1.4) v1(18.97,11.68) v1(19.06,6.35) v1(19.03,5.56) v1(19.03,4.75) v1(18.99,3.84) v1(18.99,3.03) v1(19.09,7.16) v1(19.7,19.49) v1(19.69,18.61) v1(19.74,16.07) v1(19.73,15.18) v1(19.74,14.34) v1(19.76,1.34) v1(19.86,10.78) v1(19.85,9.89) v1(19.84,3.87) v1(19.8,2.97) v1(19.8,2.15) v1(19.88,13.41) v1(19.87,12.53) v1(19.89,11.68) v1(19.87,9.05) v1(20.61,19.49) v1(20.61,18.61) v1(20.65,16.07) v1(20.64,15.18) v1(20.66,14.34) v1(20.64,2.96) v1(20.64,2.14) v1(20.6,1.33) v1(20.7,13.39) v1(20.69,12.5) v1(20.7,11.66) v1(20.68,10.75) v1(20.67,9.87) v1(20.69,9.02) v1(20.68,3.86) v1(21.53,19.49) v1(21.52,18.61) v1(21.56,16.07) v1(21.56,15.18) v1(21.53,2.91) v1(21.53,2.1) v1(21.49,1.29) v1(21.57,14.34) v1(21.61,13.39) v1(21.6,12.5) v1(21.62,11.66) v1(21.59,10.75) v1(21.59,9.87) v1(21.6,9.02) v1(21.57,3.82) v1(22.36,2.92) v1(22.36,2.11) v1(22.32,1.3) v1(22.44,19.49) v1(22.44,18.61) v1(22.4,3.83) v1(22.47,16.06) v1(22.47,15.17) v1(22.48,14.32) v1(22.53,13.39) v1(22.52,12.5) v1(22.53,11.66) v1(22.51,10.75) v1(22.5,9.87) v1(22.52,9.02) v1(23.26,1.3) v1(23.35,19.48) v1(23.34,18.59) v1(23.34,3.83) v1(23.3,2.92) v1(23.3,2.11) v1(23.39,16.06) v1(23.38,15.17) v1(23.4,14.32) v1(23.44,13.39) v1(23.43,12.5) v1(23.45,11.66) v1(23.42,10.75) v1(23.42,9.87) v1(23.43,9.02) v1(24.15,2.93) v1(24.15,2.12) v1(24.11,1.31) v1(24.26,19.48) v1(24.26,18.59) v1(24.22,13.38) v1(24.21,12.5) v1(24.22,11.65) v1(24.2,10.74) v1(24.19,9.86) v1(24.21,9.01) v1(24.19,3.84) v1(24.3,16.06) v1(24.3,15.17) v1(24.31,14.32) v1(24.95,1.31) v1(25.03,3.85) v1(24.99,2.94) v1(24.98,2.13) v1(25.13,13.38) v1(25.13,12.5) v1(25.14,11.65) v1(25.12,10.74) v1(25.11,9.86) v1(25.12,9.01) v1(25.18,19.48) v1(25.17,18.59) v1(25.22,16.06) v1(25.21,15.17) v1(25.22,14.32) v1(25.96,19.47) v1(25.95,18.59) v1(25.96,3.85) v1(25.93,2.94) v1(25.92,2.13) v1(25.88,1.31) v1(26,16.05) v1(25.99,15.17) v1(26,14.32) v1(26.05,13.38) v1(26.04,12.5) v1(26.05,11.65) v1(26.03,10.74) v1(26.02,9.86) v1(26.04,9.01) v1(26.09,21.2) v1(26.08,20.31) v1(26.74,2.17) v1(26.73,1.36) v1(26.86,18.59) v1(26.78,3.8) v1(26.78,2.99) v1(26.87,19.47) v1(26.91,16.05) v1(26.9,15.17) v1(26.92,14.32) v1(26.96,13.38) v1(26.95,12.5) v1(26.94,10.74) v1(26.94,9.86) v1(26.95,9.01) v1(27.03,22.11) v1(27,21.2) v1(27,20.31) v1(26.97,11.65) v1(27.62,3.79) v1(27.62,2.97) v1(27.58,2.16) v1(27.58,1.35) v1(27.78,19.47) v1(27.78,18.59) v1(27.83,16.05) v1(27.82,15.17) v1(27.83,14.32) v1(27.86,13.42) v1(27.85,12.54) v1(27.82,10.77) v1(27.81,9.89) v1(27.83,9.04) v1(27.92,22.11) v1(27.92,21.2) v1(27.91,20.31) v1(27.87,11.69) v1(28.06,23.06) v1(28.46,1.31) v1(28.51,3.75) v1(28.51,2.93) v1(28.47,2.12) v1(28.72,22.1) v1(28.7,21.19) v1(28.69,20.31) v1(28.7,19.47) v1(28.69,18.59) v1(28.74,16.05) v1(28.73,15.17) v1(28.75,14.32) v1(28.73,10.77) v1(28.73,9.89) v1(28.74,9.04) v1(28.86,23.06) v1(28.78,13.42) v1(28.77,12.54) v1(28.78,11.69) v1(29.34,3.76) v1(29.34,2.94) v1(29.3,2.13) v1(29.3,1.32) v1(29.64,22.1) v1(29.61,21.19) v1(29.6,20.31) v1(29.58,19.46) v1(29.57,18.57) v1(29.67,15.13) v1(29.65,10.77) v1(29.64,9.89) v1(29.66,9.04) v1(29.67,16.01) v1(29.68,14.28) v1(29.69,13.42) v1(29.68,12.54) v1(29.7,11.69) v1(29.78,23.06) v1(30.24,2.13) v1(30.23,1.32) v1(30.28,3.76) v1(30.28,2.94) v1(30.55,22.1) v1(30.52,21.19) v1(30.52,20.31) v1(30.49,19.46) v1(30.49,18.57) v1(30.56,10.77) v1(30.56,9.89) v1(30.59,16.01) v1(30.58,15.13) v1(30.59,14.28) v1(30.6,13.42) v1(30.6,12.54) v1(30.61,11.69) v1(30.57,9.04) v1(30.69,23.06) v1(31.13,3.76) v1(31.13,2.95) v1(31.09,2.14) v1(31.09,1.32) v1(31.34,10.77) v1(31.33,9.89) v1(31.35,9.04) v1(31.46,22.1) v1(31.44,21.19) v1(31.43,20.31) v1(31.41,19.46) v1(31.4,18.57) v1(31.38,13.41) v1(31.38,12.53) v1(31.39,11.68) v1(31.5,16.01) v1(31.5,15.13) v1(31.51,14.28) v1(31.6,23.06) v1(31.96,2.96) v1(31.93,2.15) v1(31.92,1.33) v1(31.97,3.77) v1(32.25,10.77) v1(32.25,9.89) v1(32.26,9.04) v1(32.34,21.16) v1(32.33,20.28) v1(32.32,19.46) v1(32.3,13.41) v1(32.29,12.53) v1(32.3,11.68) v1(32.39,22.08) v1(32.42,16.01) v1(32.41,15.13) v1(32.42,14.28) v1(32.86,2.15) v1(32.86,1.33) v1(32.91,3.77) v1(32.9,2.96) v1(33.16,9.89) v1(33.23,21.16) v1(33.22,20.28) v1(33.21,15.15) v1(33.21,13.41) v1(33.2,12.53) v1(33.22,11.68) v1(33.17,10.77) v1(33.18,9.04) v1(33.27,14.29) v1(33.86,3.85) v1(33.82,2.95) v1(33.82,2.13) v1(33.78,1.32) v1(33.99,20.74) v1(34.07,14.25) v1(34.12,13.41) v1(34.12,12.53) v1(34.13,11.68) v1(34.08,10.77) v1(34.08,9.89) v1(34.09,9.04) v1(34.65,2.96) v1(34.65,2.14) v1(34.61,1.33) v1(34.69,3.87) v1(34.9,13.4) v1(34.89,12.55) v1(34.91,11.7) v1(34.92,10.78) v1(34.92,9.9) v1(34.93,9.05) v1(35.55,1.33) v1(35.63,3.87) v1(35.59,2.96) v1(35.59,2.14) v1(35.81,12.55) v1(35.82,11.7) v1(35.84,10.78) v1(35.83,9.9) v1(35.85,9.05) v1(36.45,3.82) v1(36.44,3) v1(36.4,2.19) v1(36.4,1.38) v1(36.73,11.73) v1(36.75,10.78) v1(36.75,9.9) v1(36.76,9.05) v1(37.25,2.18) v1(37.24,1.37) v1(37.29,3.81) v1(37.28,2.99) v1(37.66,9.9) v1(37.67,10.78) v1(37.67,9.05) v1(38.13,2.14) v1(38.13,1.33) v1(38.17,3.77) v1(38.17,2.95) v1(38.59,9) v1(38.97,2.15) v1(38.96,1.34) v1(39.01,3.78) v1(39,2.96) v1(39.95,3.78) v1(39.94,2.96) v1(39.9,2.15) v1(39.9,1.34) v1(40.76,2.16) v1(40.76,1.34) v1(40.8,3.78) v1(40.8,2.97) v1(41.63,3.79) v1(41.63,2.98) v1(41.59,2.17) v1(41.59,1.35) v1(42.53,2.17) v1(42.53,1.35) v1(42.57,3.79) v1(42.57,2.98) v1(43.31,3.03) v1(43.37,2.17) v1(43.38,1.33) v1(44.25,3.03) v1(44.21,2.18) v1(44.24,1.34) v1(45.14,2.18) v1(45.07,1.35) v1(46.01,1.35) v1(60.97,86.88) v1(60.96,86) v1(60.97,85.15) v1(61.88,86.88) v1(61.87,86) v1(61.89,85.15) v1(62.79,86.88) v1(62.79,86) v1(62.8,85.15) v1(63.71,86.88) v1(63.7,86) v1(63.72,85.15) v1(64.49,86.88) v1(64.48,85.99) v1(64.49,85.15) v1(64.76,82.6) v1(64.94,19.29) v1(65.02,27.11) v1(65.02,20.31) v1(64.99,17.41) v1(65.1,26.36) v1(65.08,25.48) v1(65.07,24.6) v1(65.09,23.75) v1(65.07,21.36) v1(65.15,18.44) v1(65.4,86.88) v1(65.39,85.99) v1(65.41,85.15) v1(65.45,27.71) v1(65.52,16.53) v1(65.65,82.6) v1(65.65,81.68) v1(65.65,80.77) v1(66.23,27.71) v1(66.32,86.88) v1(66.31,85.99) v1(66.32,85.15) v1(66.3,16.52) v1(66.53,82.54) v1(66.53,81.62) v1(66.53,80.71) v1(66.53,79.79) v1(67.14,27.71) v1(67.23,86.88) v1(67.22,85.99) v1(67.24,85.15) v1(67.21,16.52) v1(67.42,82.53) v1(67.42,81.61) v1(67.42,80.7) v1(67.42,79.79) v1(67.41,79.01) v1(67.76,14.71) v1(67.76,12.98) v1(67.76,12.06) v1(67.76,11.15) v1(67.76,10.23) v1(67.76,9.45) v1(67.79,15.52) v1(67.79,13.79) v1(68.05,86.85) v1(68.04,85.97) v1(68.05,85.12) v1(68.06,27.71) v1(68.13,16.52) v1(68.28,82.49) v1(68.28,81.58) v1(68.28,80.66) v1(68.28,79.75) v1(68.28,78.97) v1(68.28,78.06) v1(68.65,14.7) v1(68.65,12.97) v1(68.65,12.05) v1(68.65,11.14) v1(68.65,10.23) v1(68.64,9.45) v1(68.67,15.52) v1(68.68,13.79) v1(68.96,86.85) v1(68.95,85.97) v1(68.97,85.12) v1(68.97,27.71) v1(69.04,16.52) v1(69.17,82.49) v1(69.17,81.57) v1(69.17,80.66) v1(69.17,79.74) v1(69.16,78.97) v1(69.16,78.05) v1(69.52,15.53) v1(69.49,14.71) v1(69.52,13.8) v1(69.5,12.98) v1(69.5,12.07) v1(69.5,11.15) v1(69.5,10.24) v1(69.49,9.46) v1(69.75,27.7) v1(69.88,86.85) v1(69.87,85.97) v1(69.88,85.12) v1(69.97,82.46) v1(69.97,81.54) v1(69.97,80.63) v1(69.97,79.71) v1(69.96,78.94) v1(69.96,78.02) v1(69.96,77.11) v1(69.96,76.19) v1(69.94,75.37) v1(69.94,74.46) v1(69.94,73.55) v1(69.97,16.64) v1(70.46,15.53) v1(70.44,14.71) v1(70.44,13.8) v1(70.44,12.88) v1(70.44,11.97) v1(70.43,11.19) v1(70.43,10.25) v1(70.58,27.64) v1(70.73,17.03) v1(70.79,86.85) v1(70.78,85.97) v1(70.8,85.12) v1(70.85,82.45) v1(70.85,81.54) v1(70.85,80.62) v1(70.85,79.71) v1(70.85,78.93) v1(70.85,78.01) v1(70.85,77.1) v1(70.85,76.19) v1(70.82,75.37) v1(70.82,74.45) v1(70.82,73.54) v1(71.11,27.19) v1(71.34,16.44) v1(71.35,15.52) v1(71.32,14.7) v1(71.32,13.79) v1(71.32,12.87) v1(71.32,11.96) v1(71.32,11.18) v1(71.27,10.27) v1(71.41,17.48) v1(71.56,85.96) v1(71.57,86.85) v1(71.58,85.12) v1(71.67,75.38) v1(71.67,74.47) v1(71.67,73.55) v1(71.62,26.62) v1(71.7,82.46) v1(71.7,81.55) v1(71.7,80.63) v1(71.7,79.72) v1(71.69,78.94) v1(71.69,78.03) v1(71.69,77.11) v1(71.69,76.2) v1(72.14,26.06) v1(72.13,17.99) v1(72.16,11.2) v1(72.19,16.45) v1(72.19,15.53) v1(72.17,14.72) v1(72.17,13.8) v1(72.17,12.89) v1(72.17,11.97) v1(72.48,86.85) v1(72.48,85.96) v1(72.49,85.12) v1(72.56,82.27) v1(72.56,81.36) v1(72.53,80.28) v1(72.53,79.37) v1(72.53,78.45) v1(72.53,77.54) v1(72.53,76.76) v1(72.53,75.84) v1(72.53,74.93) v1(72.53,74.02) v1(72.5,73.2) v1(72.5,72.28) v1(72.5,71.37) v1(72.5,70.45) v1(72.5,69.68) v1(72.5,68.76) v1(72.5,67.85) v1(72.5,66.93) v1(72.56,61.8) v1(72.55,60.08) v1(72.54,59.2) v1(72.59,65.32) v1(72.58,64.44) v1(72.59,63.59) v1(72.57,62.69) v1(72.58,60.96) v1(72.67,25.5) v1(72.97,44.63) v1(72.96,43.75) v1(72.97,42.05) v1(72.96,41.17) v1(72.96,39.44) v1(72.95,38.56) v1(72.97,37.71) v1(72.99,49.88) v1(72.98,49) v1(73,48.15) v1(72.98,47.27) v1(72.98,46.38) v1(72.99,45.54) v1(72.97,42.9) v1(72.97,40.32) v1(72.99,18.49) v1(73.11,17.38) v1(73.11,16.47) v1(73.11,15.55) v1(73.11,14.64) v1(73.1,13.86) v1(73.11,12.96) v1(73.21,24.96) v1(73.4,86.85) v1(73.39,85.96) v1(73.4,85.12) v1(73.42,80.27) v1(73.42,79.36) v1(73.42,78.44) v1(73.42,77.53) v1(73.41,76.75) v1(73.41,75.84) v1(73.41,74.92) v1(73.41,74.01) v1(73.38,73.19) v1(73.38,72.28) v1(73.38,71.36) v1(73.38,70.45) v1(73.38,69.67) v1(73.38,68.76) v1(73.38,67.84) v1(73.38,66.93) v1(73.46,60.08) v1(73.46,59.2) v1(73.47,82.26) v1(73.47,81.35) v1(73.5,65.32) v1(73.49,64.44) v1(73.51,63.59) v1(73.48,62.69) v1(73.48,61.8) v1(73.49,60.96) v1(73.62,24.44) v1(73.59,18.89) v1(73.87,38.56) v1(73.86,36.8) v1(73.9,49.88) v1(73.9,49) v1(73.91,48.15) v1(73.9,47.27) v1(73.89,46.38) v1(73.9,45.54) v1(73.88,44.63) v1(73.87,43.75) v1(73.89,42.9) v1(73.88,42.05) v1(73.87,41.17) v1(73.89,40.32) v1(73.87,39.44) v1(73.88,37.71) v1(73.96,12.97) v1(74,23.91) v1(74,23.03) v1(74.01,22.18) v1(73.99,21.27) v1(73.98,20.39) v1(73.99,19.54) v1(74.02,18.19) v1(73.99,17.38) v1(73.99,16.46) v1(73.99,15.55) v1(73.99,14.63) v1(73.99,13.85) v1(74.26,80.29) v1(74.26,79.37) v1(74.26,78.46) v1(74.26,77.54) v1(74.26,76.77) v1(74.26,75.85) v1(74.26,74.94) v1(74.26,74.02) v1(74.23,73.2) v1(74.23,72.29) v1(74.23,71.38) v1(74.23,70.46) v1(74.23,69.68) v1(74.23,68.77) v1(74.23,67.86) v1(74.23,66.94) v1(74.31,86.85) v1(74.31,85.96) v1(74.32,85.12) v1(74.35,82.26) v1(74.35,81.34) v1(74.42,65.32) v1(74.41,64.44) v1(74.42,63.59) v1(74.4,62.69) v1(74.39,61.8) v1(74.41,60.96) v1(74.38,60.08) v1(74.37,59.2) v1(74.76,35.92) v1(74.82,49.88) v1(74.81,49) v1(74.83,48.15) v1(74.81,47.27) v1(74.8,46.38) v1(74.82,45.54) v1(74.79,44.63) v1(74.79,43.75) v1(74.8,42.9) v1(74.79,42.05) v1(74.79,41.17) v1(74.8,40.32) v1(74.79,39.44) v1(74.78,38.56) v1(74.79,37.71) v1(74.77,36.8) v1(74.84,23.3) v1(74.81,22.49) v1(74.81,21.57) v1(74.81,20.66) v1(74.81,19.74) v1(74.87,18.21) v1(74.84,17.39) v1(74.84,16.47) v1(74.84,15.56) v1(74.84,14.65) v1(74.84,13.87) v1(75.17,76.74) v1(75.17,75.83) v1(75.17,74.91) v1(75.17,74) v1(75.14,73.18) v1(75.14,72.27) v1(75.14,71.35) v1(75.14,70.44) v1(75.13,69.66) v1(75.13,68.75) v1(75.13,67.83) v1(75.13,66.92) v1(75.2,86.86) v1(75.2,82.27) v1(75.2,81.35) v1(75.17,80.26) v1(75.17,79.35) v1(75.17,78.43) v1(75.17,77.52) v1(75.33,65.32) v1(75.32,64.44) v1(75.34,63.59) v1(75.31,62.69) v1(75.31,61.8) v1(75.32,60.96) v1(75.29,60.08) v1(75.56,18.03) v1(75.56,17.11) v1(75.56,16.2) v1(75.56,15.28) v1(75.66,22.5) v1(75.66,21.59) v1(75.66,20.67) v1(75.66,19.76) v1(75.59,18.85) v1(75.73,49.88) v1(75.73,49) v1(75.74,48.15) v1(75.73,47.27) v1(75.72,46.38) v1(75.73,45.54) v1(75.71,44.63) v1(75.7,43.75) v1(75.72,42.9) v1(75.71,42.05) v1(75.7,41.17) v1(75.72,40.32) v1(75.7,39.44) v1(75.7,38.56) v1(75.71,37.71) v1(75.69,36.8) v1(75.68,35.92) v1(75.69,35.07) v1(76.05,80.26) v1(76.05,79.34) v1(76.05,78.43) v1(76.05,77.51) v1(76.05,76.73) v1(76.05,75.82) v1(76.05,74.91) v1(76.05,73.99) v1(76.02,73.17) v1(76.02,72.26) v1(76.02,71.34) v1(76.02,70.43) v1(76.02,69.65) v1(76.02,68.74) v1(76.02,67.82) v1(76.02,66.91) v1(76.12,86.86) v1(76.11,82.25) v1(76.11,81.33) v1(76.11,65.32) v1(76.1,64.44) v1(76.12,63.59) v1(76.09,62.68) v1(76.08,61.8) v1(76.1,60.95) v1(76.07,60.08) v1(76.46,36.8) v1(76.46,35.91) v1(76.4,34.1) v1(76.43,18.86) v1(76.41,18.04) v1(76.41,17.13) v1(76.41,16.21) v1(76.41,15.3) v1(76.51,49.88) v1(76.5,48.99) v1(76.52,48.15) v1(76.5,47.26) v1(76.5,46.38) v1(76.51,45.53) v1(76.49,44.62) v1(76.48,43.74) v1(76.49,42.89) v1(76.49,42.05) v1(76.48,41.16) v1(76.49,40.32) v1(76.48,39.43) v1(76.47,38.55) v1(76.49,37.7) v1(76.47,35.07) v1(76.54,21.57) v1(76.54,20.66) v1(76.54,19.74) v1(76.87,69.67) v1(76.87,68.75) v1(76.87,67.84) v1(76.87,66.92) v1(76.9,80.27) v1(76.9,79.36) v1(76.9,78.44) v1(76.9,77.53) v1(76.9,76.75) v1(76.9,75.83) v1(76.9,74.92) v1(76.9,74.01) v1(76.87,73.19) v1(76.87,72.27) v1(76.87,71.36) v1(76.87,70.44) v1(77.03,86.86) v1(76.99,82.24) v1(76.99,81.32) v1(77.02,65.32) v1(77.02,64.44) v1(77.03,63.59) v1(77.01,62.68) v1(77,61.8) v1(77.01,60.95) v1(76.98,60.08) v1(77.32,34.1) v1(77.31,33.21) v1(77.36,18.88) v1(77.34,18.06) v1(77.34,17.14) v1(77.34,16.23) v1(77.43,49.88) v1(77.42,48.99) v1(77.43,48.15) v1(77.42,47.26) v1(77.41,46.38) v1(77.42,45.53) v1(77.4,44.62) v1(77.39,43.74) v1(77.41,42.89) v1(77.4,42.05) v1(77.39,41.16) v1(77.41,40.32) v1(77.39,39.43) v1(77.39,38.55) v1(77.4,37.7) v1(77.38,36.8) v1(77.37,35.91) v1(77.38,35.07) v1(77.41,21.59) v1(77.41,20.68) v1(77.41,19.76) v1(77.75,73.17) v1(77.75,72.26) v1(77.75,71.34) v1(77.75,70.43) v1(77.75,69.65) v1(77.75,68.74) v1(77.75,67.82) v1(77.75,66.91) v1(77.84,82.25) v1(77.84,81.34) v1(77.78,80.26) v1(77.78,79.34) v1(77.78,78.43) v1(77.78,77.51) v1(77.78,76.73) v1(77.78,75.82) v1(77.78,74.91) v1(77.78,73.99) v1(77.95,86.86) v1(77.94,65.32) v1(77.93,64.44) v1(77.94,63.59) v1(77.92,62.68) v1(77.91,61.8) v1(78.23,34.1) v1(78.22,33.21) v1(78.24,32.37) v1(78.34,49.88) v1(78.33,48.99) v1(78.35,48.15) v1(78.33,47.26) v1(78.33,46.38) v1(78.34,45.53) v1(78.32,44.62) v1(78.31,43.74) v1(78.32,42.89) v1(78.32,42.05) v1(78.31,41.16) v1(78.32,40.32) v1(78.31,39.43) v1(78.3,38.55) v1(78.32,37.7) v1(78.29,36.8) v1(78.29,35.91) v1(78.3,35.07) v1(78.66,76.73) v1(78.66,75.81) v1(78.66,74.9) v1(78.66,73.98) v1(78.64,73.17) v1(78.64,72.25) v1(78.64,71.34) v1(78.64,70.42) v1(78.63,69.65) v1(78.63,68.73) v1(78.63,67.82) v1(78.63,66.9) v1(78.72,86.86) v1(78.72,82.24) v1(78.72,81.32) v1(78.67,80.25) v1(78.67,79.33) v1(78.67,78.42) v1(78.67,77.51) v1(78.85,65.32) v1(78.84,64.44) v1(78.86,63.59) v1(78.83,62.68) v1(78.83,61.8) v1(78.93,31.33) v1(79.01,34.09) v1(79,33.21) v1(79.01,32.36) v1(79.25,49.88) v1(79.25,48.99) v1(79.26,48.15) v1(79.25,47.26) v1(79.24,46.38) v1(79.25,45.53) v1(79.23,44.62) v1(79.22,43.74) v1(79.24,42.89) v1(79.23,42.05) v1(79.22,41.16) v1(79.24,40.32) v1(79.22,39.43) v1(79.22,38.55) v1(79.23,37.7) v1(79.21,36.8) v1(79.2,35.91) v1(79.21,35.07) v1(79.51,80.26) v1(79.51,79.35) v1(79.51,78.43) v1(79.51,77.52) v1(79.51,76.74) v1(79.51,75.83) v1(79.51,74.91) v1(79.51,74) v1(79.48,73.18) v1(79.48,72.27) v1(79.48,71.35) v1(79.48,70.44) v1(79.48,69.66) v1(79.48,68.75) v1(79.48,67.83) v1(79.48,66.92) v1(79.64,86.86) v1(79.6,82.23) v1(79.6,81.32) v1(79.66,64.41) v1(79.65,62.65) v1(79.64,61.77) v1(79.67,65.29) v1(79.68,63.56) v1(79.85,31.33) v1(79.84,30.45) v1(79.92,34.09) v1(79.92,33.21) v1(79.93,32.36) v1(80.06,48.97) v1(80.06,47.23) v1(80.06,46.35) v1(80.05,44.6) v1(80.04,43.71) v1(80.06,42.87) v1(80.05,42.02) v1(80.04,41.14) v1(80.06,40.29) v1(80.04,39.41) v1(80.03,38.52) v1(80.05,37.68) v1(80.02,36.77) v1(80.02,35.89) v1(80.03,35.04) v1(80.07,49.85) v1(80.08,48.12) v1(80.07,45.5) v1(80.45,82.24) v1(80.45,81.33) v1(80.42,80.24) v1(80.42,79.32) v1(80.42,78.41) v1(80.42,77.5) v1(80.42,76.72) v1(80.42,75.8) v1(80.42,74.89) v1(80.42,73.97) v1(80.39,73.16) v1(80.39,72.24) v1(80.39,71.33) v1(80.39,70.41) v1(80.39,69.64) v1(80.39,68.72) v1(80.39,67.81) v1(80.39,66.89) v1(80.55,86.86) v1(80.57,62.65) v1(80.56,61.77) v1(80.58,65.29) v1(80.58,64.41) v1(80.59,63.56) v1(80.76,31.33) v1(80.75,30.45) v1(80.84,34.09) v1(80.83,33.21) v1(80.84,32.36) v1(80.77,29.6) v1(80.96,44.6) v1(80.96,43.71) v1(80.96,42.02) v1(80.96,41.14) v1(80.96,39.41) v1(80.95,38.52) v1(80.96,37.68) v1(80.94,36.77) v1(80.93,35.89) v1(80.95,35.04) v1(80.99,49.85) v1(80.98,48.97) v1(80.99,48.12) v1(80.98,47.23) v1(80.97,46.35) v1(80.99,45.5) v1(80.97,42.87) v1(80.97,40.29) v1(81.36,82.22) v1(81.36,81.31) v1(81.31,80.23) v1(81.31,79.32) v1(81.31,78.4) v1(81.31,77.49) v1(81.3,76.71) v1(81.3,75.8) v1(81.3,74.88) v1(81.3,73.97) v1(81.27,73.15) v1(81.27,72.24) v1(81.27,71.32) v1(81.27,70.41) v1(81.27,69.63) v1(81.27,68.71) v1(81.27,67.8) v1(81.27,66.89) v1(81.42,28.57) v1(81.47,86.86) v1(81.5,65.29) v1(81.49,64.41) v1(81.5,63.56) v1(81.48,62.65) v1(81.47,61.77) v1(81.54,31.33) v1(81.53,30.44) v1(81.55,29.6) v1(81.75,34.09) v1(81.74,33.21) v1(81.76,32.36) v1(81.86,38.52) v1(81.85,36.77) v1(81.85,35.89) v1(81.86,35.04) v1(81.9,49.85) v1(81.89,48.97) v1(81.91,48.12) v1(81.89,47.23) v1(81.89,46.35) v1(81.9,45.5) v1(81.88,44.6) v1(81.87,43.71) v1(81.88,42.87) v1(81.88,42.02) v1(81.87,41.14) v1(81.88,40.29) v1(81.87,39.41) v1(81.88,37.68) v1(82.15,80.25) v1(82.15,79.33) v1(82.15,78.42) v1(82.15,77.5) v1(82.15,76.73) v1(82.15,75.81) v1(82.15,74.9) v1(82.15,73.98) v1(82.12,73.16) v1(82.12,72.25) v1(82.12,71.34) v1(82.12,70.42) v1(82.12,69.64) v1(82.12,68.73) v1(82.12,67.81) v1(82.12,66.9) v1(82.24,82.21) v1(82.24,81.3) v1(82.29,86.83) v1(82.33,28.57) v1(82.32,27.68) v1(82.41,65.29) v1(82.41,64.41) v1(82.42,63.56) v1(82.4,62.65) v1(82.39,61.77) v1(82.45,31.33) v1(82.45,30.44) v1(82.46,29.6) v1(82.56,33.18) v1(82.57,34.07) v1(82.58,32.34) v1(82.76,35.89) v1(82.82,49.85) v1(82.81,48.97) v1(82.82,48.12) v1(82.81,47.23) v1(82.8,46.35) v1(82.81,45.5) v1(82.79,44.6) v1(82.78,43.71) v1(82.8,42.87) v1(82.79,42.02) v1(82.78,41.14) v1(82.8,40.29) v1(82.78,39.41) v1(82.78,38.52) v1(82.79,37.68) v1(82.77,36.77) v1(82.78,35.04) v1(82.96,1.17) v1(83.09,82.23) v1(83.09,81.31) v1(83.13,80.28) v1(83.13,79.37) v1(83.13,78.45) v1(83.13,77.54) v1(83.12,76.76) v1(83.12,75.84) v1(83.12,74.93) v1(83.12,74.02) v1(83.09,73.2) v1(83.09,72.28) v1(83.09,71.37) v1(83.09,70.45) v1(83.09,69.68) v1(83.09,68.76) v1(83.09,67.85) v1(83.09,66.93) v1(83.17,61.77) v1(83.2,86.83) v1(83.19,65.29) v1(83.18,64.41) v1(83.2,63.56) v1(83.17,62.65) v1(83.25,28.57) v1(83.24,27.68) v1(83.25,26.84) v1(83.36,30.44) v1(83.43,34.1) v1(83.42,33.21) v1(83.44,32.37) v1(83.37,31.33) v1(83.38,29.6) v1(83.56,43.71) v1(83.56,41.13) v1(83.56,39.4) v1(83.56,38.52) v1(83.55,36.76) v1(83.54,35.88) v1(83.55,35.03) v1(83.59,49.84) v1(83.59,48.96) v1(83.6,48.11) v1(83.59,47.23) v1(83.58,46.35) v1(83.59,45.5) v1(83.57,44.59) v1(83.58,42.86) v1(83.57,42.02) v1(83.58,40.29) v1(83.57,37.67) v1(83.79,2) v1(83.79,1.18) v1(84.06,82.26) v1(84.06,81.35) v1(84.01,80.27) v1(84.01,79.36) v1(84.01,78.44) v1(84.01,77.53) v1(84.01,76.75) v1(84.01,75.84) v1(84.01,74.92) v1(84.01,74.01) v1(83.98,73.19) v1(83.98,72.28) v1(83.98,71.36) v1(83.98,70.45) v1(83.97,69.67) v1(83.97,68.76) v1(83.97,67.84) v1(83.97,66.93) v1(84.02,28.56) v1(84.02,27.68) v1(84.03,26.83) v1(84.11,86.83) v1(84.1,65.29) v1(84.1,64.41) v1(84.11,63.56) v1(84.09,62.65) v1(84.08,61.77) v1(84.34,34.1) v1(84.34,33.21) v1(84.35,32.37) v1(84.28,31.33) v1(84.28,30.44) v1(84.29,29.6) v1(84.46,36.76) v1(84.45,35.88) v1(84.47,35.03) v1(84.51,49.84) v1(84.5,48.96) v1(84.51,48.11) v1(84.5,47.23) v1(84.49,46.35) v1(84.51,45.5) v1(84.48,44.59) v1(84.48,43.71) v1(84.49,42.86) v1(84.48,42.02) v1(84.48,41.13) v1(84.49,40.29) v1(84.48,39.4) v1(84.47,38.52) v1(84.48,37.67) v1(84.66,1.98) v1(84.65,1.16) v1(84.69,2.79) v1(84.86,80.29) v1(84.86,79.37) v1(84.86,78.46) v1(84.86,77.54) v1(84.85,76.77) v1(84.85,75.85) v1(84.85,74.94) v1(84.85,74.02) v1(84.83,73.2) v1(84.83,72.29) v1(84.83,71.38) v1(84.83,70.46) v1(84.82,69.68) v1(84.82,68.77) v1(84.82,67.86) v1(84.82,66.94) v1(84.95,82.26) v1(84.95,81.34) v1(84.94,28.56) v1(84.93,27.68) v1(84.95,26.83) v1(85.03,86.83) v1(85.02,65.29) v1(85.01,64.41) v1(85.03,63.56) v1(85,62.65) v1(85,61.77) v1(85.1,31.3) v1(85.09,30.42) v1(85.11,29.57) v1(85.26,34.1) v1(85.25,33.21) v1(85.27,32.37) v1(85.42,49.84) v1(85.41,48.96) v1(85.43,48.11) v1(85.41,47.23) v1(85.41,46.35) v1(85.42,45.5) v1(85.4,44.59) v1(85.39,43.71) v1(85.41,42.86) v1(85.4,42.02) v1(85.39,41.13) v1(85.41,40.29) v1(85.39,39.4) v1(85.38,38.52) v1(85.4,37.67) v1(85.37,36.76) v1(85.37,35.88) v1(85.38,35.03) v1(85.53,3.61) v1(85.53,2.8) v1(85.49,1.99) v1(85.48,1.17) v1(85.76,80.26) v1(85.76,79.35) v1(85.76,78.43) v1(85.76,77.52) v1(85.76,76.74) v1(85.76,75.83) v1(85.76,74.91) v1(85.76,74) v1(85.73,73.18) v1(85.73,72.27) v1(85.73,71.35) v1(85.73,70.44) v1(85.73,69.66) v1(85.73,68.75) v1(85.73,67.83) v1(85.73,66.92) v1(85.81,86.82) v1(85.79,82.27) v1(85.79,81.35) v1(85.84,31.32) v1(85.84,30.44) v1(85.85,29.59) v1(85.85,28.56) v1(85.85,27.68) v1(85.86,26.83) v1(85.93,65.29) v1(85.93,64.41) v1(85.94,63.56) v1(85.92,62.65) v1(85.91,61.77) v1(86.17,33.21) v1(86.17,34.1) v1(86.18,32.37) v1(86.34,49.84) v1(86.33,48.96) v1(86.34,48.11) v1(86.33,47.23) v1(86.32,46.35) v1(86.34,45.5) v1(86.31,44.59) v1(86.31,43.71) v1(86.32,42.86) v1(86.31,42.02) v1(86.31,41.13) v1(86.32,40.29) v1(86.31,39.4) v1(86.3,38.52) v1(86.31,37.67) v1(86.29,36.76) v1(86.28,35.88) v1(86.3,35.03) v1(86.46,2.8) v1(86.43,1.99) v1(86.42,1.17) v1(86.47,3.61) v1(86.65,80.26) v1(86.65,79.34) v1(86.65,78.43) v1(86.65,77.51) v1(86.64,76.73) v1(86.64,75.82) v1(86.64,74.91) v1(86.64,73.99) v1(86.62,73.17) v1(86.62,72.26) v1(86.62,71.34) v1(86.62,70.43) v1(86.61,69.65) v1(86.61,68.74) v1(86.61,67.82) v1(86.61,66.91) v1(86.72,86.82) v1(86.7,82.25) v1(86.7,81.33) v1(86.76,31.32) v1(86.75,30.44) v1(86.76,29.59) v1(86.76,27.68) v1(86.86,65.25) v1(86.85,64.37) v1(86.84,62.62) v1(86.84,61.73) v1(86.77,28.56) v1(86.77,26.83) v1(86.87,63.52) v1(87.34,1.16) v1(87.46,73.19) v1(87.46,72.27) v1(87.46,71.36) v1(87.46,70.44) v1(87.46,69.67) v1(87.46,68.75) v1(87.46,67.84) v1(87.46,66.92) v1(87.45,5.44) v1(87.42,4.53) v1(87.42,3.69) v1(87.38,2.79) v1(87.38,1.97) v1(87.5,80.27) v1(87.5,79.36) v1(87.5,78.44) v1(87.5,77.53) v1(87.49,76.75) v1(87.49,75.83) v1(87.49,74.92) v1(87.49,74.01) v1(87.64,86.82) v1(87.58,82.24) v1(87.58,81.32) v1(87.59,28.53) v1(87.58,27.65) v1(87.59,26.8) v1(87.76,62.62) v1(87.75,61.73) v1(87.78,65.25) v1(87.77,64.37) v1(87.78,63.52) v1(88.21,6.2) v1(88.25,4.54) v1(88.25,3.71) v1(88.22,2.8) v1(88.21,1.98) v1(88.17,1.17) v1(88.35,73.17) v1(88.35,72.26) v1(88.35,71.34) v1(88.35,70.43) v1(88.34,69.65) v1(88.34,68.74) v1(88.34,67.82) v1(88.34,66.91) v1(88.29,5.45) v1(88.43,82.25) v1(88.43,81.34) v1(88.38,80.26) v1(88.38,79.34) v1(88.38,78.43) v1(88.38,77.51) v1(88.37,76.73) v1(88.37,75.82) v1(88.37,74.91) v1(88.37,73.99) v1(88.55,86.82) v1(88.67,61.73) v1(88.69,65.25) v1(88.68,64.37) v1(88.7,63.52) v1(88.67,62.62) v1(89.04,6.21) v1(89.08,7.12) v1(89.15,2.8) v1(89.15,1.98) v1(89.11,1.17) v1(89.26,80.25) v1(89.26,79.33) v1(89.26,78.42) v1(89.26,77.51) v1(89.26,76.73) v1(89.26,75.81) v1(89.26,74.9) v1(89.26,73.98) v1(89.23,73.17) v1(89.23,72.25) v1(89.23,71.34) v1(89.23,70.42) v1(89.23,69.65) v1(89.23,68.73) v1(89.23,67.82) v1(89.23,66.9) v1(89.23,5.45) v1(89.19,4.54) v1(89.19,3.71) v1(89.34,86.78) v1(89.31,82.24) v1(89.31,81.32) v1(89.6,65.25) v1(89.6,64.37) v1(89.61,63.52) v1(89.59,62.62) v1(89.58,61.73) v1(89.66,48.87) v1(89.66,47.99) v1(89.66,45.43) v1(89.66,44.55) v1(89.64,43.76) v1(89.66,42.91) v1(89.63,42.01) v1(89.63,41.12) v1(89.66,31.47) v1(89.66,30.59) v1(89.67,47.19) v1(89.69,46.34) v1(89.69,40.08) v1(89.7,39.23) v1(89.67,38.32) v1(89.67,37.44) v1(89.69,36.68) v1(89.7,35.83) v1(89.67,34.93) v1(89.67,34.04) v1(89.67,33.22) v1(89.69,32.38) v1(89.81,7.95) v1(89.97,2.03) v1(89.96,1.22) v1(90.02,7.12) v1(89.98,6.21) v1(90.04,5.4) v1(90.04,4.59) v1(90.01,3.66) v1(90,2.84) v1(90.11,80.26) v1(90.11,79.35) v1(90.11,78.43) v1(90.11,77.52) v1(90.1,76.74) v1(90.1,75.83) v1(90.1,74.91) v1(90.1,74) v1(90.08,73.18) v1(90.08,72.27) v1(90.08,71.35) v1(90.08,70.44) v1(90.07,69.66) v1(90.07,68.75) v1(90.07,67.83) v1(90.07,66.92) v1(90.25,86.78) v1(90.2,82.23) v1(90.2,81.32) v1(90.37,62.61) v1(90.36,61.73) v1(90.38,65.25) v1(90.38,64.37) v1(90.39,63.52) v1(90.46,43.73) v1(90.45,41.98) v1(90.44,41.09) v1(90.51,49.75) v1(90.48,48.84) v1(90.48,47.96) v1(90.49,47.16) v1(90.51,46.31) v1(90.48,45.4) v1(90.48,44.52) v1(90.47,42.89) v1(90.5,40.05) v1(90.52,39.2) v1(90.49,38.29) v1(90.49,37.41) v1(90.5,36.65) v1(90.52,35.81) v1(90.49,34.9) v1(90.49,34.02) v1(90.49,33.2) v1(90.51,32.35) v1(90.48,31.44) v1(90.48,30.56) v1(90.49,29.71) v1(90.65,7.97) v1(90.68,8.87) v1(90.77,85.76) v1(90.78,84.91) v1(90.83,7.07) v1(90.83,6.25) v1(90.85,3.65) v1(90.85,2.83) v1(90.81,2.02) v1(90.81,1.21) v1(90.88,5.39) v1(90.88,4.58) v1(91.04,82.24) v1(91.04,81.33) v1(91.02,80.24) v1(91.02,79.32) v1(91.02,78.41) v1(91.02,77.5) v1(91.01,76.72) v1(91.01,75.8) v1(91.01,74.89) v1(91.01,73.97) v1(90.98,73.16) v1(90.98,72.24) v1(90.98,71.33) v1(90.98,70.41) v1(90.98,69.64) v1(90.98,68.72) v1(90.98,67.81) v1(90.98,66.89) v1(91.17,86.78) v1(91.26,59.09) v1(91.3,65.25) v1(91.29,64.37) v1(91.3,63.52) v1(91.28,62.61) v1(91.27,61.73) v1(91.29,60.88) v1(91.27,59.97) v1(91.37,41.98) v1(91.36,41.09) v1(91.41,50.6) v1(91.42,49.75) v1(91.4,48.84) v1(91.39,47.96) v1(91.41,47.16) v1(91.42,46.31) v1(91.4,45.4) v1(91.39,44.52) v1(91.38,43.73) v1(91.39,42.89) v1(91.42,40.05) v1(91.43,39.2) v1(91.41,38.29) v1(91.4,37.41) v1(91.42,36.65) v1(91.43,35.81) v1(91.41,34.9) v1(91.4,34.02) v1(91.41,33.2) v1(91.42,32.35) v1(91.4,31.44) v1(91.39,30.56) v1(91.4,29.71) v1(91.62,8.87) v1(91.58,7.97) v1(91.68,85.76) v1(91.7,84.91) v1(91.68,7.06) v1(91.67,6.24) v1(91.74,3.61) v1(91.73,2.79) v1(91.7,1.98) v1(91.69,1.17) v1(91.86,69.63) v1(91.86,68.71) v1(91.86,67.8) v1(91.86,66.89) v1(91.77,5.35) v1(91.77,4.53) v1(91.95,82.22) v1(91.95,81.31) v1(91.9,80.23) v1(91.9,79.32) v1(91.9,78.4) v1(91.9,77.49) v1(91.9,76.71) v1(91.9,75.8) v1(91.9,74.88) v1(91.9,73.97) v1(91.87,73.15) v1(91.87,72.24) v1(91.87,71.32) v1(91.87,70.41) v1(92.08,86.78) v1(92.21,65.25) v1(92.2,64.37) v1(92.22,63.52) v1(92.19,62.61) v1(92.19,61.73) v1(92.2,60.88) v1(92.18,59.97) v1(92.18,59.09) v1(92.24,51.4) v1(92.27,47.94) v1(92.27,44.5) v1(92.25,43.71) v1(92.27,42.86) v1(92.24,41.95) v1(92.24,41.07) v1(92.27,30.54) v1(92.28,50.58) v1(92.3,49.73) v1(92.27,48.82) v1(92.28,47.14) v1(92.3,46.29) v1(92.27,45.38) v1(92.29,40.03) v1(92.31,39.18) v1(92.28,38.27) v1(92.28,37.39) v1(92.29,36.63) v1(92.31,35.78) v1(92.28,34.88) v1(92.28,33.99) v1(92.28,33.17) v1(92.3,32.33) v1(92.27,31.42) v1(92.28,29.69) v1(92.44,8.82) v1(92.43,8.01) v1(92.56,7.02) v1(92.56,6.2) v1(92.53,1.99) v1(92.53,1.18) v1(92.6,85.76) v1(92.61,84.91) v1(92.6,5.36) v1(92.6,4.54) v1(92.57,3.62) v1(92.57,2.8) v1(92.75,80.25) v1(92.75,79.33) v1(92.75,78.42) v1(92.75,77.5) v1(92.74,76.73) v1(92.74,75.81) v1(92.74,74.9) v1(92.74,73.98) v1(92.72,73.16) v1(92.72,72.25) v1(92.72,71.34) v1(92.72,70.42) v1(92.71,69.64) v1(92.71,68.73) v1(92.71,67.81) v1(92.71,66.9) v1(92.86,86.78) v1(92.84,82.21) v1(92.84,81.3) v1(93.06,52.26) v1(93.05,51.37) v1(93.06,41.93) v1(93.05,41.04) v1(93.13,65.25) v1(93.12,64.37) v1(93.13,63.52) v1(93.11,62.61) v1(93.1,61.73) v1(93.12,60.88) v1(93.1,59.97) v1(93.09,59.09) v1(93.1,50.55) v1(93.12,49.7) v1(93.09,48.79) v1(93.09,47.91) v1(93.1,47.11) v1(93.12,46.26) v1(93.09,45.35) v1(93.09,44.47) v1(93.07,43.68) v1(93.08,42.83) v1(93.11,40) v1(93.13,39.15) v1(93.1,38.24) v1(93.09,37.36) v1(93.11,36.6) v1(93.13,35.76) v1(93.1,34.85) v1(93.09,33.97) v1(93.1,33.15) v1(93.12,32.3) v1(93.09,31.39) v1(93.09,30.51) v1(93.1,29.66) v1(93.28,8.81) v1(93.28,8) v1(93.46,73.17) v1(93.46,72.26) v1(93.46,71.34) v1(93.46,70.43) v1(93.45,69.65) v1(93.45,68.73) v1(93.45,67.82) v1(93.45,66.91) v1(93.4,7.03) v1(93.39,6.21) v1(93.47,1.99) v1(93.46,1.18) v1(93.51,85.76) v1(93.52,84.91) v1(93.49,80.25) v1(93.49,79.34) v1(93.49,78.42) v1(93.49,77.51) v1(93.48,76.73) v1(93.48,75.82) v1(93.48,74.9) v1(93.48,73.99) v1(93.54,5.36) v1(93.54,4.54) v1(93.51,3.62) v1(93.51,2.8) v1(93.68,82.23) v1(93.68,81.31) v1(93.77,86.78) v1(93.94,65.22) v1(93.94,64.34) v1(93.95,63.49) v1(93.93,62.58) v1(93.92,61.7) v1(93.93,60.85) v1(93.92,59.94) v1(93.91,59.06) v1(94,53.16) v1(93.98,52.26) v1(93.97,51.37) v1(94.02,50.55) v1(94.03,49.7) v1(94.01,48.79) v1(94,47.91) v1(94.02,47.11) v1(94.03,46.26) v1(94.01,45.35) v1(94,44.47) v1(93.98,43.68) v1(94,42.83) v1(93.97,41.93) v1(93.97,41.04) v1(94.03,40) v1(94.04,39.15) v1(94.02,38.24) v1(94.01,37.36) v1(94.03,36.6) v1(94.04,35.76) v1(94.02,34.85) v1(94.01,33.97) v1(94.02,33.15) v1(94.03,32.3) v1(94.01,31.39) v1(94,30.51) v1(94.01,29.66) v1(94.16,7.96) v1(94.17,8.77) v1(94.37,76.72) v1(94.37,75.81) v1(94.37,74.9) v1(94.37,73.98) v1(94.34,73.16) v1(94.34,72.25) v1(94.34,71.33) v1(94.34,70.42) v1(94.34,69.64) v1(94.34,68.73) v1(94.34,67.81) v1(94.34,66.9) v1(94.42,82.23) v1(94.42,81.32) v1(94.37,80.25) v1(94.37,79.33) v1(94.37,78.42) v1(94.37,77.5) v1(94.39,1.18) v1(94.86,65.22) v1(94.85,64.34) v1(94.87,63.49) v1(94.84,62.58) v1(94.83,61.7) v1(94.85,60.85) v1(94.83,59.94) v1(94.82,59.06) v1(94.84,58.21) v1(94.9,54.01) v1(94.91,53.16) v1(94.89,52.26) v1(94.88,51.37) v1(94.93,50.55) v1(94.94,49.7) v1(94.92,48.79) v1(94.91,47.91) v1(94.93,47.11) v1(94.94,46.26) v1(94.92,45.35) v1(94.91,44.47) v1(94.9,43.68) v1(94.91,42.83) v1(94.89,41.93) v1(94.88,41.04) v1(94.94,40) v1(94.95,39.15) v1(94.93,38.24) v1(94.92,37.36) v1(94.94,36.6) v1(94.95,35.76) v1(94.93,34.85) v1(94.92,33.97) v1(94.93,33.15) v1(94.94,32.3) v1(94.92,31.39) v1(94.91,30.51) v1(94.93,29.66) v1(95,8.78) v1(95,7.97) v1(95.16,7.07) v1(95.22,80.26) v1(95.22,79.34) v1(95.22,78.43) v1(95.22,77.52) v1(95.21,76.74) v1(95.21,75.82) v1(95.21,74.91) v1(95.21,74) v1(95.19,73.18) v1(95.19,72.26) v1(95.19,71.35) v1(95.19,70.43) v1(95.18,69.66) v1(95.18,68.74) v1(95.18,67.83) v1(95.18,66.91) v1(95.18,6.21) v1(95.26,1.14) v1(95.31,82.23) v1(95.31,81.31) v1(95.66,56.69) v1(95.65,55.81) v1(95.77,64.34) v1(95.76,62.58) v1(95.75,61.7) v1(95.76,60.85) v1(95.75,59.94) v1(95.74,59.06) v1(95.75,58.21) v1(95.67,54.96) v1(95.77,65.22) v1(95.78,63.49) v1(95.81,54.01) v1(95.83,53.16) v1(95.8,52.26) v1(95.8,51.37) v1(95.84,50.55) v1(95.86,49.7) v1(95.84,48.79) v1(95.83,47.91) v1(95.84,47.11) v1(95.86,46.26) v1(95.84,45.35) v1(95.83,44.47) v1(95.81,43.68) v1(95.83,42.83) v1(95.8,41.93) v1(95.8,41.04) v1(95.86,40) v1(95.85,38.24) v1(95.84,37.36) v1(95.86,36.6) v1(95.85,34.85) v1(95.84,33.97) v1(95.84,33.15) v1(95.86,32.3) v1(95.84,31.39) v1(95.83,30.51) v1(95.84,29.66) v1(95.87,39.15) v1(95.87,35.76) v1(95.94,8.78) v1(95.94,7.97) v1(95.95,6.21) v1(95.97,7.05) v1(96.15,82.24) v1(96.15,81.33) v1(96.13,80.24) v1(96.13,79.32) v1(96.13,78.41) v1(96.13,77.49) v1(96.12,76.71) v1(96.12,75.8) v1(96.12,74.89) v1(96.12,73.97) v1(96.09,73.15) v1(96.09,72.24) v1(96.09,71.32) v1(96.09,70.41) v1(96.09,69.63) v1(96.09,68.72) v1(96.09,67.8) v1(96.09,66.89) v1(96.21,1.03) v1(96.66,61.7) v1(96.66,59.94) v1(96.65,59.06) v1(96.67,58.21) v1(96.57,56.69) v1(96.57,55.81) v1(96.58,54.96) v1(96.59,54.01) v1(96.61,53.16) v1(96.58,52.25) v1(96.58,51.37) v1(96.62,50.54) v1(96.64,49.7) v1(96.61,48.79) v1(96.61,47.91) v1(96.62,47.11) v1(96.64,46.26) v1(96.61,45.35) v1(96.61,44.47) v1(96.59,43.68) v1(96.61,42.83) v1(96.58,41.92) v1(96.57,41.04) v1(96.63,40) v1(96.65,39.15) v1(96.62,38.24) v1(96.62,37.36) v1(96.63,36.6) v1(96.65,35.75) v1(96.62,34.84) v1(96.62,33.96) v1(96.62,33.14) v1(96.64,32.29) v1(96.61,31.39) v1(96.61,30.5) v1(96.62,29.66) v1(96.69,65.22) v1(96.68,64.34) v1(96.69,63.49) v1(96.67,62.58) v1(96.68,60.85) v1(96.76,8.77) v1(96.74,7.99) v1(96.8,7.07) v1(96.8,6.26) v1(97.06,82.22) v1(97.06,81.3) v1(97.01,80.23) v1(97.01,79.31) v1(97.01,78.4) v1(97.01,77.49) v1(97,76.71) v1(97,75.79) v1(97,74.88) v1(97,73.96) v1(96.98,73.15) v1(96.98,72.23) v1(96.98,71.32) v1(96.98,70.4) v1(96.97,69.62) v1(96.97,68.71) v1(96.97,67.8) v1(96.97,66.88) v1(97.02,1.19) v1(97.46,65.22) v1(97.46,64.33) v1(97.45,62.58) v1(97.44,61.7) v1(97.45,60.85) v1(97.44,59.94) v1(97.43,59.06) v1(97.44,58.21) v1(97.47,63.49) v1(97.49,56.69) v1(97.48,55.81) v1(97.5,54.96) v1(97.51,54.01) v1(97.52,53.16) v1(97.5,52.25) v1(97.49,51.37) v1(97.54,50.54) v1(97.55,49.7) v1(97.53,48.79) v1(97.52,47.91) v1(97.54,47.11) v1(97.55,46.26) v1(97.53,45.35) v1(97.52,44.47) v1(97.51,43.68) v1(97.52,42.83) v1(97.5,41.92) v1(97.49,41.04) v1(97.55,40) v1(97.56,39.15) v1(97.54,38.24) v1(97.53,37.36) v1(97.55,36.6) v1(97.56,35.75) v1(97.54,34.84) v1(97.53,33.96) v1(97.54,33.14) v1(97.55,32.29) v1(97.53,31.39) v1(97.52,30.5) v1(97.53,29.66) v1(97.56,8.73) v1(97.56,7.92) v1(97.64,7.06) v1(97.64,6.25) v1(97.75,5.37) v1(97.86,80.24) v1(97.86,79.33) v1(97.86,78.41) v1(97.86,77.5) v1(97.85,76.72) v1(97.85,75.81) v1(97.85,74.89) v1(97.85,73.98) v1(97.82,73.16) v1(97.82,72.25) v1(97.82,71.33) v1(97.82,70.42) v1(97.82,69.64) v1(97.82,68.72) v1(97.82,67.81) v1(97.82,66.9) v1(97.8,1.56) v1(97.94,82.21) v1(97.94,81.3) v1(98.36,62.58) v1(98.35,61.7) v1(98.35,59.94) v1(98.34,59.06) v1(98.36,58.21) v1(98.31,4.51) v1(98.3,2.2) v1(98.38,65.22) v1(98.37,64.33) v1(98.39,63.49) v1(98.37,60.85) v1(98.4,56.69) v1(98.4,55.81) v1(98.41,54.96) v1(98.42,54.01) v1(98.44,53.16) v1(98.41,52.25) v1(98.4,51.37) v1(98.45,50.54) v1(98.47,49.7) v1(98.44,48.79) v1(98.43,47.91) v1(98.45,47.11) v1(98.47,46.26) v1(98.44,45.35) v1(98.43,44.47) v1(98.42,43.68) v1(98.43,42.83) v1(98.41,41.92) v1(98.4,41.04) v1(98.46,40) v1(98.45,38.24) v1(98.44,37.36) v1(98.46,36.6) v1(98.45,34.84) v1(98.44,33.96) v1(98.45,33.14) v1(98.47,32.29) v1(98.44,31.39) v1(98.44,30.5) v1(98.45,29.66) v1(98.4,8.74) v1(98.39,7.93) v1(98.48,39.15) v1(98.48,35.75) v1(98.53,7.02) v1(98.53,6.21) v1(98.64,3.73) v1(98.6,2.91) v1(98.77,80.28) v1(98.77,79.36) v1(98.77,78.45) v1(98.77,77.53) v1(98.76,76.75) v1(98.76,75.84) v1(98.76,74.93) v1(98.76,74.01) v1(98.73,73.19) v1(98.73,72.28) v1(98.73,71.36) v1(98.73,70.45) v1(98.73,69.67) v1(98.73,68.76) v1(98.73,67.84) v1(98.73,66.93) v1(98.79,82.22) v1(98.79,81.31) v1(99.27,59.94) v1(99.26,59.06) v1(99.18,56.69) v1(99.17,55.81) v1(99.19,54.96) v1(99.29,65.22) v1(99.29,64.33) v1(99.3,63.49) v1(99.28,62.58) v1(99.27,61.7) v1(99.28,60.85) v1(99.27,58.21) v1(99.34,54.01) v1(99.35,53.16) v1(99.33,52.25) v1(99.32,51.37) v1(99.37,50.54) v1(99.36,48.79) v1(99.35,47.91) v1(99.37,47.11) v1(99.36,45.35) v1(99.35,44.47) v1(99.34,43.68) v1(99.35,42.83) v1(99.32,41.92) v1(99.32,41.04) v1(99.37,38.24) v1(99.36,37.36) v1(99.37,34.84) v1(99.36,33.96) v1(99.37,33.14) v1(99.36,31.39) v1(99.35,30.5) v1(99.36,29.66) v1(99.34,8.74) v1(99.33,7.93) v1(99.37,7.03) v1(99.36,6.22) v1(99.38,49.7) v1(99.38,46.26) v1(99.38,40) v1(99.39,39.15) v1(99.38,36.6) v1(99.39,35.75) v1(99.38,32.29) v2(3.52,3.45) v2(4.02,85.45) v2(96.02,85.45) v2(96.02,3.45)
